# EAGLE schematic sensor_frontend_test_v0.5.e8a143b4 (EAGLE 7.7.0)

## Sheet 1 of 6
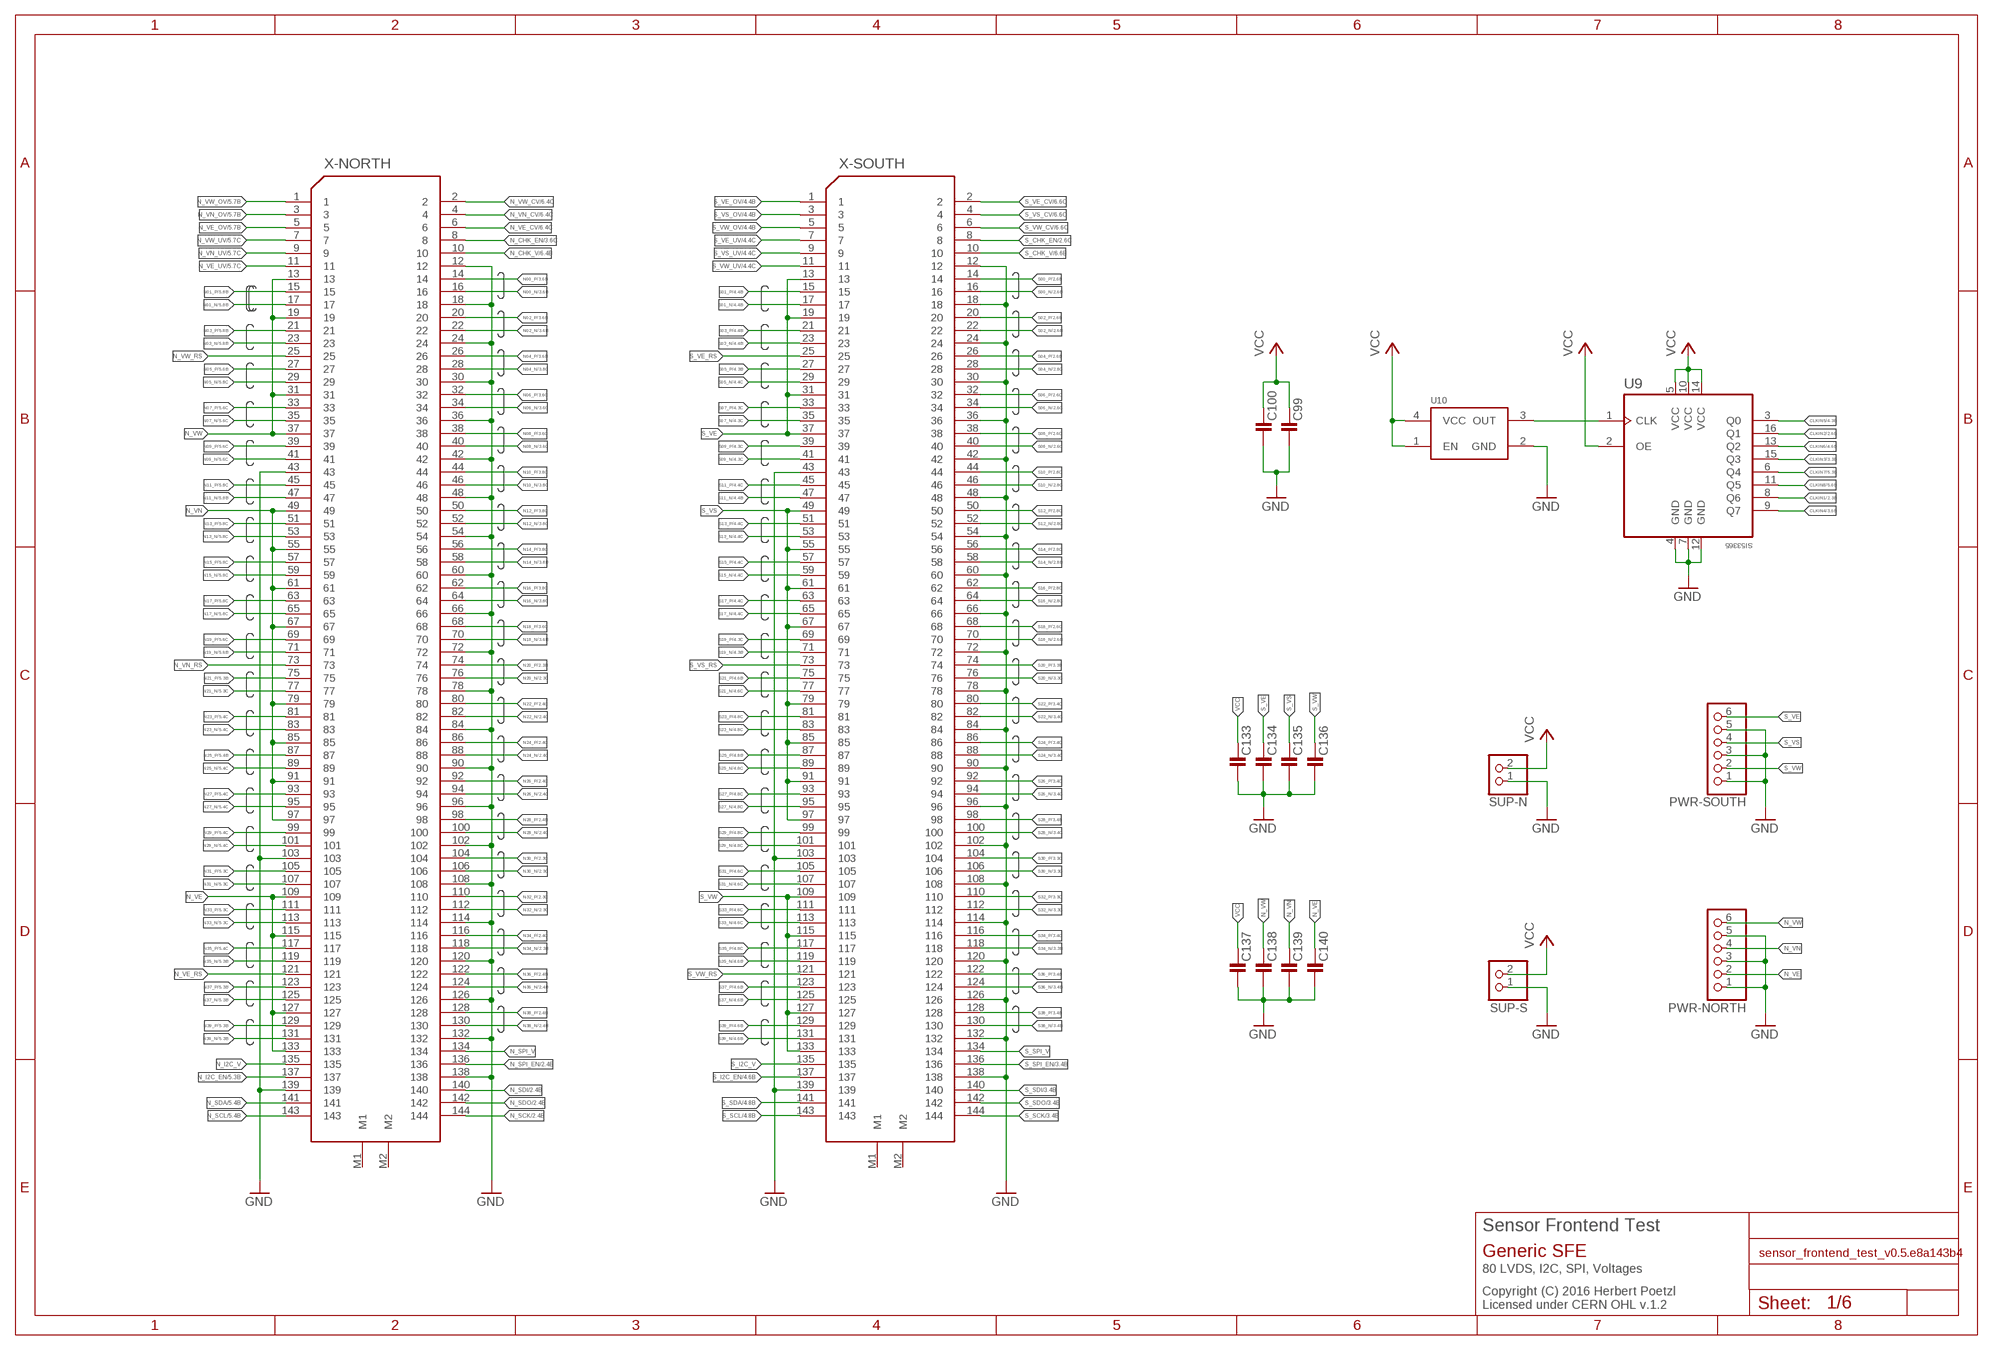
[diagram p0: schematic, sheet 1]

### Parts
C99  C0402-B  [0402-B]
C100  C0402-B  [0402-B]
C133  C0805-A  [0805-A]
C134  C0805-A  [0805-A]
C135  C0805-A  [0805-A]
C136  C0805-A  [0805-A]
C137  C0805-A  [0805-A]
C138  C0805-A  [0805-A]
C139  C0805-A  [0805-A]
C140  C0805-A  [0805-A]
PWR-NORTH  PINHD-1X06_2.54-S  [1X06-S]
PWR-SOUTH  PINHD-1X06_2.54-S  [1X06-S]
SUP-N  PINHD-1X02_2.54-S  [1X02-S]
SUP-S  PINHD-1X02_2.54-S  [1X02-S]
U9  SI53365  [SOP65P640X120-16N]
U10  OSCILLATOR5X3-PIN1-INDICATED  [CRYSTAL-OSC-SMD-5X3]
X-NORTH  FX10-144S  [FX10A-144S]
X-SOUTH  FX10-144S  [FX10A-144S]

### Nets
CLKIN1: U9.8(Q6) ; also sheet 2
CLKIN2: U9.16(Q1) ; also sheet 2
CLKIN3: U9.15(Q3) ; also sheet 3
CLKIN4: U9.9(Q7) ; also sheet 3
CLKIN5: U9.3(Q0) ; also sheet 4
CLKIN6: U9.13(Q2) ; also sheet 4
CLKIN7: U9.6(Q4) ; also sheet 5
CLKIN8: U9.11(Q5) ; also sheet 5
GND [power]: C99.2 C100.2 C133.2 C134.2 C135.2 C136.2 C137.2 C138.2 C139.2 C140.2 PWR-NORTH.1 PWR-NORTH.3 PWR-NORTH.5 PWR-SOUTH.1 PWR-SOUTH.3 PWR-SOUTH.5 SUP-N.1 SUP-S.1 U9.4(GND) U9.7(GND) U9.12(GND) U10.2(GND) X-NORTH.12 X-NORTH.18 X-NORTH.24 X-NORTH.30 X-NORTH.36 X-NORTH.42 X-NORTH.43 X-NORTH.48 X-NORTH.54 X-NORTH.60 X-NORTH.66 X-NORTH.72 X-NORTH.78 X-NORTH.84 X-NORTH.90 X-NORTH.96 X-NORTH.102 X-NORTH.103 X-NORTH.108 X-NORTH.114 X-NORTH.120 X-NORTH.126 X-NORTH.132 X-NORTH.138 X-NORTH.139 X-SOUTH.12 X-SOUTH.18 X-SOUTH.24 X-SOUTH.30 X-SOUTH.36 X-SOUTH.42 X-SOUTH.43 X-SOUTH.48 X-SOUTH.54 X-SOUTH.60 X-SOUTH.66 X-SOUTH.72 X-SOUTH.78 X-SOUTH.84 X-SOUTH.90 X-SOUTH.96 X-SOUTH.102 X-SOUTH.103 X-SOUTH.108 X-SOUTH.114 X-SOUTH.120 X-SOUTH.126 X-SOUTH.132 X-SOUTH.138 X-SOUTH.139 ; also sheet 2,3,4,5,6
N00_N [analog]: X-NORTH.16 ; also sheet 3
N00_P [analog]: X-NORTH.14 ; also sheet 3
N01_N [analog]: X-NORTH.17 ; also sheet 5
N01_P [analog]: X-NORTH.15 ; also sheet 5
N02_N [analog]: X-NORTH.22 ; also sheet 3
N02_P [analog]: X-NORTH.20 ; also sheet 3
N03_N [analog]: X-NORTH.23 ; also sheet 5
N03_P [analog]: X-NORTH.21 ; also sheet 5
N04_N [analog]: X-NORTH.28 ; also sheet 3
N04_P [analog]: X-NORTH.26 ; also sheet 3
N05_N [analog]: X-NORTH.29 ; also sheet 5
N05_P [analog]: X-NORTH.27 ; also sheet 5
N06_N [analog]: X-NORTH.34 ; also sheet 3
N06_P [analog]: X-NORTH.32 ; also sheet 3
N07_N [analog]: X-NORTH.35 ; also sheet 5
N07_P [analog]: X-NORTH.33 ; also sheet 5
N08_N [analog]: X-NORTH.40 ; also sheet 3
N08_P [analog]: X-NORTH.38 ; also sheet 3
N09_N [analog]: X-NORTH.41 ; also sheet 5
N09_P [analog]: X-NORTH.39 ; also sheet 5
N10_N [analog]: X-NORTH.46 ; also sheet 3
N10_P [analog]: X-NORTH.44 ; also sheet 3
N11_N [analog]: X-NORTH.47 ; also sheet 5
N11_P [analog]: X-NORTH.45 ; also sheet 5
N12_N [analog]: X-NORTH.52 ; also sheet 3
N12_P [analog]: X-NORTH.50 ; also sheet 3
N13_N [analog]: X-NORTH.53 ; also sheet 5
N13_P [analog]: X-NORTH.51 ; also sheet 5
N14_N [analog]: X-NORTH.58 ; also sheet 3
N14_P [analog]: X-NORTH.56 ; also sheet 3
N15_N [analog]: X-NORTH.59 ; also sheet 5
N15_P [analog]: X-NORTH.57 ; also sheet 5
N16_N [analog]: X-NORTH.64 ; also sheet 3
N16_P [analog]: X-NORTH.62 ; also sheet 3
N17_N [analog]: X-NORTH.65 ; also sheet 5
N17_P [analog]: X-NORTH.63 ; also sheet 5
N18_N [analog]: X-NORTH.70 ; also sheet 3
N18_P [analog]: X-NORTH.68 ; also sheet 3
N19_N [analog]: X-NORTH.71 ; also sheet 5
N19_P [analog]: X-NORTH.69 ; also sheet 5
N20_N [analog]: X-NORTH.76 ; also sheet 2
N20_P [analog]: X-NORTH.74 ; also sheet 2
N21_N [analog]: X-NORTH.77 ; also sheet 5
N21_P [analog]: X-NORTH.75 ; also sheet 5
N22_N [analog]: X-NORTH.82 ; also sheet 2
N22_P [analog]: X-NORTH.80 ; also sheet 2
N23_N [analog]: X-NORTH.83 ; also sheet 5
N23_P [analog]: X-NORTH.81 ; also sheet 5
N24_N [analog]: X-NORTH.88 ; also sheet 2
N24_P [analog]: X-NORTH.86 ; also sheet 2
N25_N [analog]: X-NORTH.89 ; also sheet 5
N25_P [analog]: X-NORTH.87 ; also sheet 5
N26_N [analog]: X-NORTH.94 ; also sheet 2
N26_P [analog]: X-NORTH.92 ; also sheet 2
N27_N [analog]: X-NORTH.95 ; also sheet 5
N27_P [analog]: X-NORTH.93 ; also sheet 5
N28_N [analog]: X-NORTH.100 ; also sheet 2
N28_P [analog]: X-NORTH.98 ; also sheet 2
N29_N [analog]: X-NORTH.101 ; also sheet 5
N29_P [analog]: X-NORTH.99 ; also sheet 5
N30_N [analog]: X-NORTH.106 ; also sheet 2
N30_P [analog]: X-NORTH.104 ; also sheet 2
N31_N [analog]: X-NORTH.107 ; also sheet 5
N31_P [analog]: X-NORTH.105 ; also sheet 5
N32_N [analog]: X-NORTH.112 ; also sheet 2
N32_P [analog]: X-NORTH.110 ; also sheet 2
N33_N [analog]: X-NORTH.113 ; also sheet 5
N33_P [analog]: X-NORTH.111 ; also sheet 5
N34_N [analog]: X-NORTH.118 ; also sheet 2
N34_P [analog]: X-NORTH.116 ; also sheet 2
N35_N [analog]: X-NORTH.119 ; also sheet 5
N35_P [analog]: X-NORTH.117 ; also sheet 5
N36_N [analog]: X-NORTH.124 ; also sheet 2
N36_P [analog]: X-NORTH.122 ; also sheet 2
N37_N [analog]: X-NORTH.125 ; also sheet 5
N37_P [analog]: X-NORTH.123 ; also sheet 5
N38_N [analog]: X-NORTH.130 ; also sheet 2
N38_P [analog]: X-NORTH.128 ; also sheet 2
N39_N [analog]: X-NORTH.131 ; also sheet 5
N39_P [analog]: X-NORTH.129 ; also sheet 5
N$7: U9.1(CLK) U10.3(OUT)
N_CHK_EN: X-NORTH.8 ; also sheet 3
N_CHK_V: X-NORTH.10 ; also sheet 6
N_I2C_EN: X-NORTH.137 ; also sheet 5
N_I2C_V: X-NORTH.135
N_SCK: X-NORTH.144 ; also sheet 2
N_SCL: X-NORTH.143 ; also sheet 5
N_SDA: X-NORTH.141 ; also sheet 5
N_SDI: X-NORTH.140 ; also sheet 2
N_SDO: X-NORTH.142 ; also sheet 2
N_SPI_EN: X-NORTH.136 ; also sheet 2
N_SPI_V: X-NORTH.134
N_VE [power]: C140.1 PWR-NORTH.2 X-NORTH.109 X-NORTH.115 X-NORTH.127 X-NORTH.133
N_VE_CV: X-NORTH.6 ; also sheet 6
N_VE_OV: X-NORTH.5 ; also sheet 5
N_VE_RS: X-NORTH.121
N_VE_UV: X-NORTH.11 ; also sheet 5
N_VN [power]: C139.1 PWR-NORTH.4 X-NORTH.49 X-NORTH.55 X-NORTH.61 X-NORTH.67 X-NORTH.79 X-NORTH.85 X-NORTH.91 X-NORTH.97
N_VN_CV: X-NORTH.4 ; also sheet 6
N_VN_OV: X-NORTH.3 ; also sheet 5
N_VN_RS: X-NORTH.73
N_VN_UV: X-NORTH.9 ; also sheet 5
N_VW [power]: C138.1 PWR-NORTH.6 X-NORTH.13 X-NORTH.19 X-NORTH.31 X-NORTH.37
N_VW_CV: X-NORTH.2 ; also sheet 6
N_VW_OV: X-NORTH.1 ; also sheet 5
N_VW_RS: X-NORTH.25
N_VW_UV: X-NORTH.7 ; also sheet 5
S00_N [analog]: X-SOUTH.16 ; also sheet 2
S00_P [analog]: X-SOUTH.14 ; also sheet 2
S01_N [analog]: X-SOUTH.17 ; also sheet 4
S01_P [analog]: X-SOUTH.15 ; also sheet 4
S02_N [analog]: X-SOUTH.22 ; also sheet 2
S02_P [analog]: X-SOUTH.20 ; also sheet 2
S03_N [analog]: X-SOUTH.23 ; also sheet 4
S03_P [analog]: X-SOUTH.21 ; also sheet 4
S04_N [analog]: X-SOUTH.28 ; also sheet 2
S04_P [analog]: X-SOUTH.26 ; also sheet 2
S05_N [analog]: X-SOUTH.29 ; also sheet 4
S05_P [analog]: X-SOUTH.27 ; also sheet 4
S06_N [analog]: X-SOUTH.34 ; also sheet 2
S06_P [analog]: X-SOUTH.32 ; also sheet 2
S07_N [analog]: X-SOUTH.35 ; also sheet 4
S07_P [analog]: X-SOUTH.33 ; also sheet 4
S08_N [analog]: X-SOUTH.40 ; also sheet 2
S08_P [analog]: X-SOUTH.38 ; also sheet 2
S09_N [analog]: X-SOUTH.41 ; also sheet 4
S09_P [analog]: X-SOUTH.39 ; also sheet 4
S10_N [analog]: X-SOUTH.46 ; also sheet 2
S10_P [analog]: X-SOUTH.44 ; also sheet 2
S11_N [analog]: X-SOUTH.47 ; also sheet 4
S11_P [analog]: X-SOUTH.45 ; also sheet 4
S12_N [analog]: X-SOUTH.52 ; also sheet 2
S12_P [analog]: X-SOUTH.50 ; also sheet 2
S13_N [analog]: X-SOUTH.53 ; also sheet 4
S13_P [analog]: X-SOUTH.51 ; also sheet 4
S14_N [analog]: X-SOUTH.58 ; also sheet 2
S14_P [analog]: X-SOUTH.56 ; also sheet 2
S15_N [analog]: X-SOUTH.59 ; also sheet 4
S15_P [analog]: X-SOUTH.57 ; also sheet 4
S16_N [analog]: X-SOUTH.64 ; also sheet 2
S16_P [analog]: X-SOUTH.62 ; also sheet 2
S17_N [analog]: X-SOUTH.65 ; also sheet 4
S17_P [analog]: X-SOUTH.63 ; also sheet 4
S18_N [analog]: X-SOUTH.70 ; also sheet 2
S18_P [analog]: X-SOUTH.68 ; also sheet 2
S19_N [analog]: X-SOUTH.71 ; also sheet 4
S19_P [analog]: X-SOUTH.69 ; also sheet 4
S20_N [analog]: X-SOUTH.76 ; also sheet 3
S20_P [analog]: X-SOUTH.74 ; also sheet 3
S21_N [analog]: X-SOUTH.77 ; also sheet 4
S21_P [analog]: X-SOUTH.75 ; also sheet 4
S22_N [analog]: X-SOUTH.82 ; also sheet 3
S22_P [analog]: X-SOUTH.80 ; also sheet 3
S23_N [analog]: X-SOUTH.83 ; also sheet 4
S23_P [analog]: X-SOUTH.81 ; also sheet 4
S24_N [analog]: X-SOUTH.88 ; also sheet 3
S24_P [analog]: X-SOUTH.86 ; also sheet 3
S25_N [analog]: X-SOUTH.89 ; also sheet 4
S25_P [analog]: X-SOUTH.87 ; also sheet 4
S26_N [analog]: X-SOUTH.94 ; also sheet 3
S26_P [analog]: X-SOUTH.92 ; also sheet 3
S27_N [analog]: X-SOUTH.95 ; also sheet 4
S27_P [analog]: X-SOUTH.93 ; also sheet 4
S28_N [analog]: X-SOUTH.100 ; also sheet 3
S28_P [analog]: X-SOUTH.98 ; also sheet 3
S29_N [analog]: X-SOUTH.101 ; also sheet 4
S29_P [analog]: X-SOUTH.99 ; also sheet 4
S30_N [analog]: X-SOUTH.106 ; also sheet 3
S30_P [analog]: X-SOUTH.104 ; also sheet 3
S31_N [analog]: X-SOUTH.107 ; also sheet 4
S31_P [analog]: X-SOUTH.105 ; also sheet 4
S32_N [analog]: X-SOUTH.112 ; also sheet 3
S32_P [analog]: X-SOUTH.110 ; also sheet 3
S33_N [analog]: X-SOUTH.113 ; also sheet 4
S33_P [analog]: X-SOUTH.111 ; also sheet 4
S34_N [analog]: X-SOUTH.118 ; also sheet 3
S34_P [analog]: X-SOUTH.116 ; also sheet 3
S35_N [analog]: X-SOUTH.119 ; also sheet 4
S35_P [analog]: X-SOUTH.117 ; also sheet 4
S36_N [analog]: X-SOUTH.124 ; also sheet 3
S36_P [analog]: X-SOUTH.122 ; also sheet 3
S37_N [analog]: X-SOUTH.125 ; also sheet 4
S37_P [analog]: X-SOUTH.123 ; also sheet 4
S38_N [analog]: X-SOUTH.130 ; also sheet 3
S38_P [analog]: X-SOUTH.128 ; also sheet 3
S39_N [analog]: X-SOUTH.131 ; also sheet 4
S39_P [analog]: X-SOUTH.129 ; also sheet 4
S_CHK_EN: X-SOUTH.8 ; also sheet 2
S_CHK_V: X-SOUTH.10 ; also sheet 6
S_I2C_EN: X-SOUTH.137 ; also sheet 4
S_I2C_V: X-SOUTH.135
S_SCK: X-SOUTH.144 ; also sheet 3
S_SCL: X-SOUTH.143 ; also sheet 4
S_SDA: X-SOUTH.141 ; also sheet 4
S_SDI: X-SOUTH.140 ; also sheet 3
S_SDO: X-SOUTH.142 ; also sheet 3
S_SPI_EN: X-SOUTH.136 ; also sheet 3
S_SPI_V: X-SOUTH.134
S_VE [power]: C134.1 PWR-SOUTH.6 X-SOUTH.13 X-SOUTH.19 X-SOUTH.31 X-SOUTH.37
S_VE_CV: X-SOUTH.2 ; also sheet 6
S_VE_OV: X-SOUTH.1 ; also sheet 4
S_VE_RS: X-SOUTH.25
S_VE_UV: X-SOUTH.7 ; also sheet 4
S_VS [power]: C135.1 PWR-SOUTH.4 X-SOUTH.49 X-SOUTH.55 X-SOUTH.61 X-SOUTH.67 X-SOUTH.79 X-SOUTH.85 X-SOUTH.91 X-SOUTH.97
S_VS_CV: X-SOUTH.4 ; also sheet 6
S_VS_OV: X-SOUTH.3 ; also sheet 4
S_VS_RS: X-SOUTH.73
S_VS_UV: X-SOUTH.9 ; also sheet 4
S_VW [power]: C136.1 PWR-SOUTH.2 X-SOUTH.109 X-SOUTH.115 X-SOUTH.127 X-SOUTH.133
S_VW_CV: X-SOUTH.6 ; also sheet 6
S_VW_OV: X-SOUTH.5 ; also sheet 4
S_VW_RS: X-SOUTH.121
S_VW_UV: X-SOUTH.11 ; also sheet 4
VCC [power]: C99.1 C100.1 C133.1 C137.1 SUP-N.2 SUP-S.2 U9.2(OE) U9.5(VCC) U9.10(VCC) U9.14(VCC) U10.1(EN) U10.4(VCC) ; also sheet 2,3,4,5
Unconnected: X-NORTH.M1 X-NORTH.M2 X-SOUTH.M1 X-SOUTH.M2

### Notes on the sheet
- Sensor Frontend Test
- Generic SFE
- 80 LVDS, I2C, SPI, Voltages
- Copyright (C) 2016 Herbert Poetzl
  Licensed under CERN OHL v.1.2

## Sheet 2 of 6
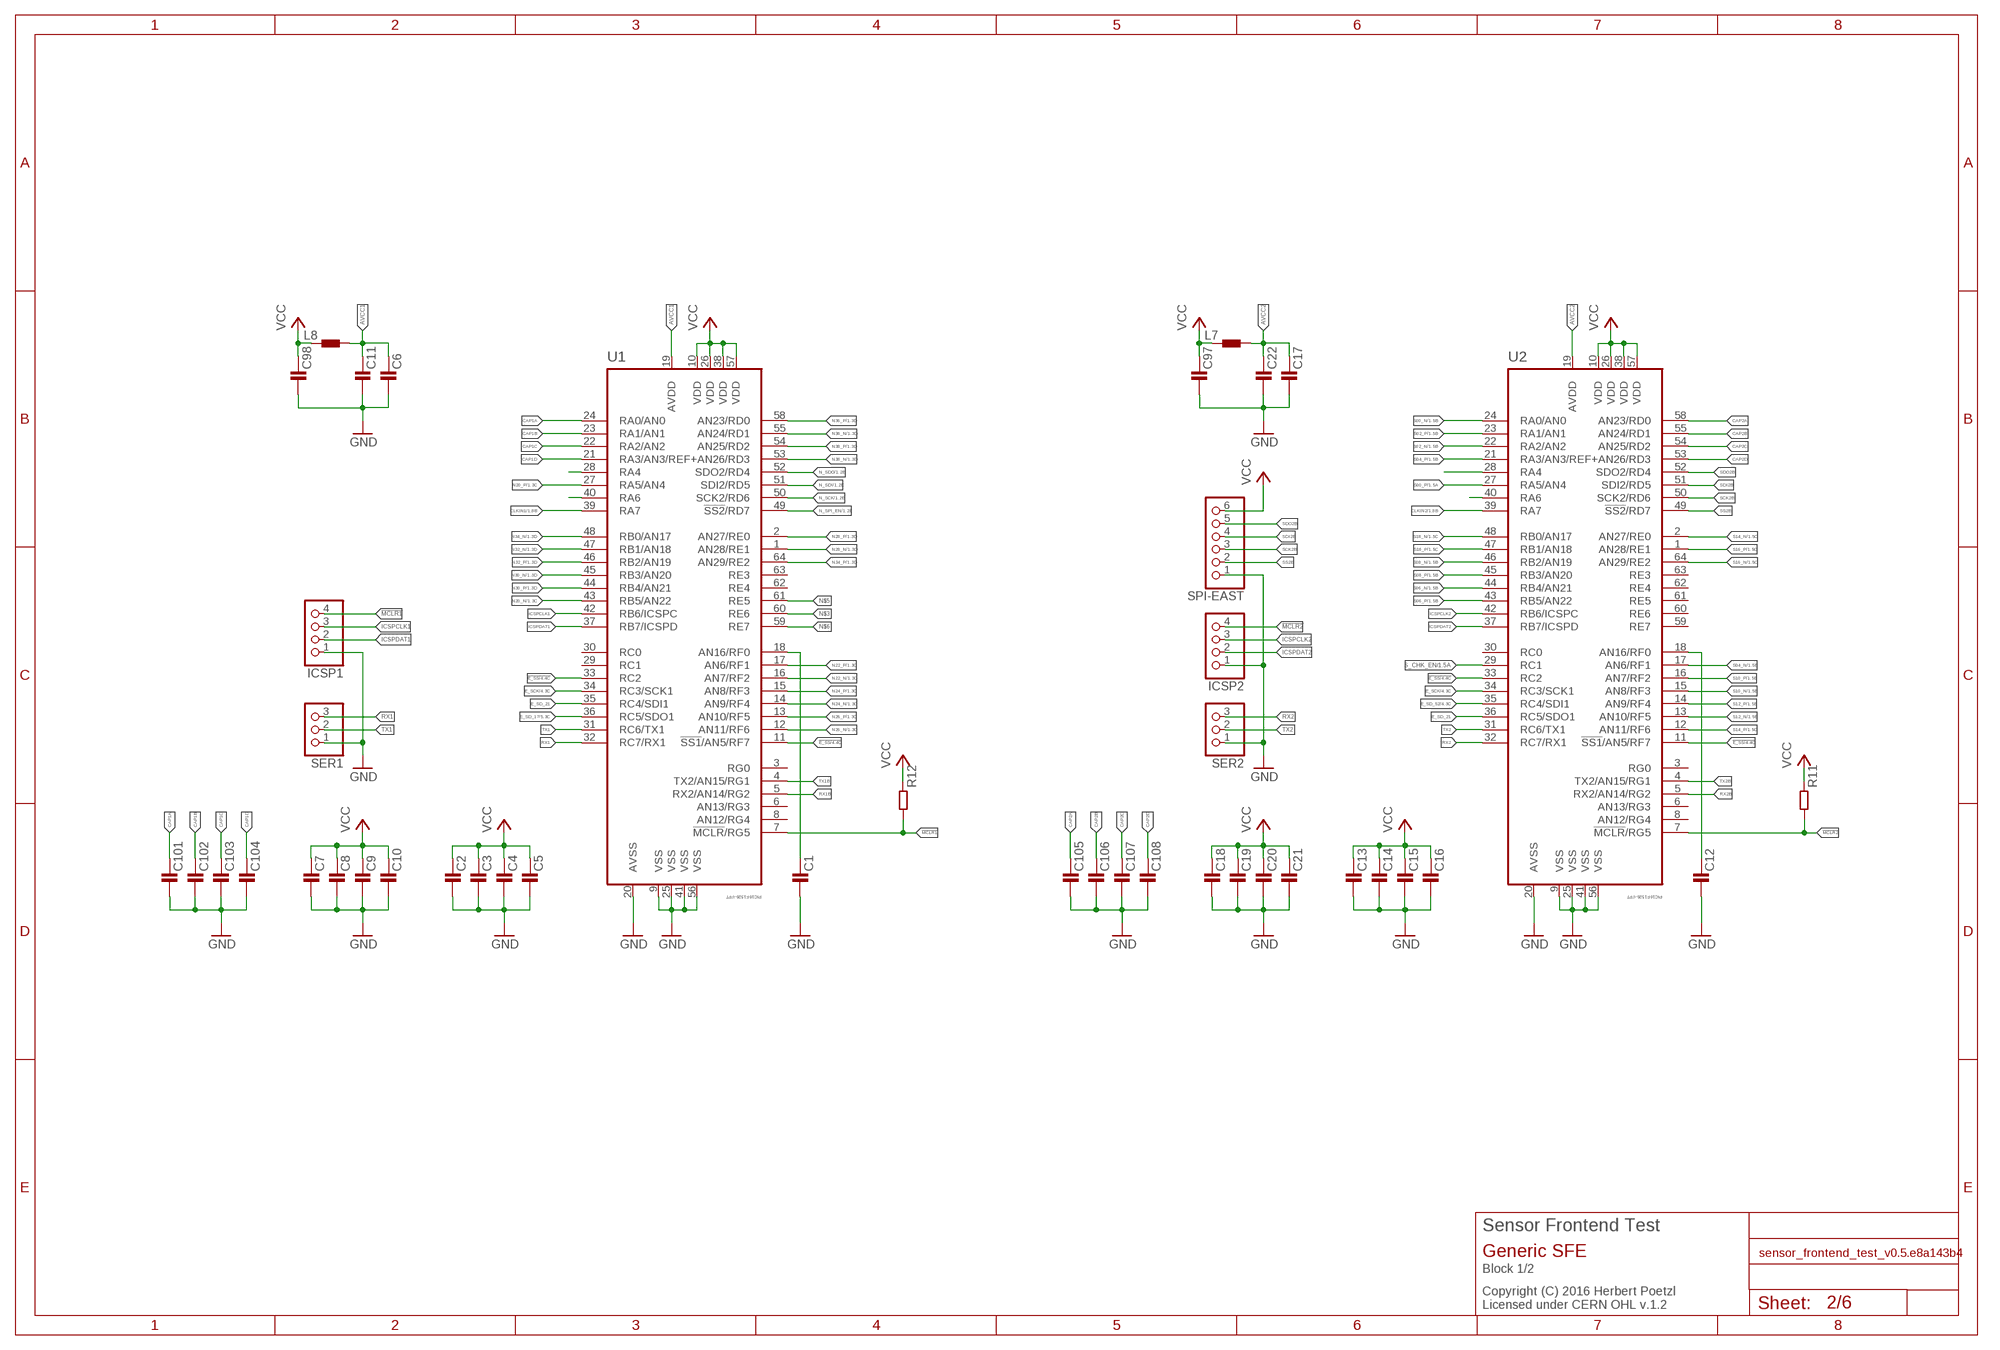
[diagram p1: schematic, sheet 2]

### Parts
C1  C0402-B  [0402-B]
C2  C0402-B  [0402-B]
C3  C0402-B  [0402-B]
C4  C0402-B  [0402-B]
C5  C0402-B  [0402-B]
C6  C0402-B  [0402-B]
C7  C0402-B  [0402-B]
C8  C0402-B  [0402-B]
C9  C0402-B  [0402-B]
C10  C0402-B  [0402-B]
C11  C0402-B  [0402-B]
C12  C0402-B  [0402-B]
C13  C0402-B  [0402-B]
C14  C0402-B  [0402-B]
C15  C0402-B  [0402-B]
C16  C0402-B  [0402-B]
C17  C0402-B  [0402-B]
C18  C0402-B  [0402-B]
C19  C0402-B  [0402-B]
C20  C0402-B  [0402-B]
C21  C0402-B  [0402-B]
C22  C0402-B  [0402-B]
C97  C0402-B  [0402-B]
C98  C0402-B  [0402-B]
C101  C0402-B  [0402-B]
C102  C0402-B  [0402-B]
C103  C0603-B  [0603-B]
C104  C0603-B  [0603-B]
C105  C0402-B  [0402-B]
C106  C0402-B  [0402-B]
C107  C0603-B  [0603-B]
C108  C0603-B  [0603-B]
ICSP1  PINHD-1X04_2.00  [1X04M]
ICSP2  PINHD-1X04_2.00  [1X04M]
L7  L0402-B  [0402-B]
L8  L0402-B  [0402-B]
R11  R0402-B  [0402-B]
R12  R0402-B  [0402-B]
SER1  PINHD-1X03_2.00  [1X03M]
SER2  PINHD-1X03_2.00  [1X03M]
SPI-EAST  PINHD-1X06_2.00  [1X06M]
U1  PIC16F1526-I/PT  [QFP50P1200X1200X120-64N]
U2  PIC16F1526-I/PT  [QFP50P1200X1200X120-64N]

### Nets
!E_SS: U1.11(!SS1!/AN5/RF7) U1.33(RC2) U2.11(!SS1!/AN5/RF7) U2.33(RC2) ; also sheet 4,5
!MCLR1!: ICSP1.4 R12.2 U1.7(!MCLR!/RG5)
!MCLR2!: ICSP2.4 R11.2 U2.7(!MCLR!/RG5)
AVCC1 [power]: C6.1 C11.1 L8.2 U1.19(AVDD)
AVCC2 [power]: C17.1 C22.1 L7.2 U2.19(AVDD)
CAP1A [analog]: C101.1 U1.24(RA0/AN0)
CAP1B [analog]: C102.1 U1.23(RA1/AN1)
CAP1C [analog]: C103.1 U1.22(RA2/AN2)
CAP1D [analog]: C104.1 U1.21(RA3/AN3/REF+)
CAP2A [analog]: C105.1 U2.58(AN23/RD0)
CAP2B [analog]: C106.1 U2.55(AN24/RD1)
CAP2C [analog]: C107.1 U2.54(AN25/RD2)
CAP2D [analog]: C108.1 U2.53(AN26/RD3)
CLKIN1: U1.39(RA7) ; also sheet 1
CLKIN2: U2.39(RA7) ; also sheet 1
E_SCK: U1.34(RC3/SCK1) U2.34(RC3/SCK1) ; also sheet 4,5
E_SD_17: U1.36(RC5/SDO1) ; also sheet 5
E_SD_21: U1.35(RC4/SDI1) U2.36(RC5/SDO1)
E_SD_52: U2.35(RC4/SDI1) ; also sheet 4
GND [power]: C1.2 C2.2 C3.2 C4.2 C5.2 C6.2 C7.2 C8.2 C9.2 C10.2 C11.2 C12.2 C13.2 C14.2 C15.2 C16.2 C17.2 C18.2 C19.2 C20.2 C21.2 C22.2 C97.2 C98.2 C101.2 C102.2 C103.2 C104.2 C105.2 C106.2 C107.2 C108.2 ICSP1.1 ICSP2.1 SER1.1 SER2.1 SPI-EAST.1 U1.9(VSS) U1.20(AVSS) U1.25(VSS) U1.41(VSS) U1.56(VSS) U2.9(VSS) U2.20(AVSS) U2.25(VSS) U2.41(VSS) U2.56(VSS) ; also sheet 1,3,4,5,6
ICSPCLK1: ICSP1.3 U1.42(RB6/ICSPC)
ICSPCLK2: ICSP2.3 U2.42(RB6/ICSPC)
ICSPDAT1: ICSP1.2 U1.37(RB7/ICSPD)
ICSPDAT2: ICSP2.2 U2.37(RB7/ICSPD)
N20_N [analog]: U1.43(RB5/AN22) ; also sheet 1
N20_P [analog]: U1.27(RA5/AN4) ; also sheet 1
N22_N [analog]: U1.16(AN7/RF2) ; also sheet 1
N22_P [analog]: U1.17(AN6/RF1) ; also sheet 1
N24_N [analog]: U1.14(AN9/RF4) ; also sheet 1
N24_P [analog]: U1.15(AN8/RF3) ; also sheet 1
N26_N [analog]: U1.12(AN11/RF6) ; also sheet 1
N26_P [analog]: U1.13(AN10/RF5) ; also sheet 1
N28_N [analog]: U1.1(AN28/RE1) ; also sheet 1
N28_P [analog]: U1.2(AN27/RE0) ; also sheet 1
N30_N [analog]: U1.45(RB3/AN20) ; also sheet 1
N30_P [analog]: U1.44(RB4/AN21) ; also sheet 1
N32_N [analog]: U1.47(RB1/AN18) ; also sheet 1
N32_P [analog]: U1.46(RB2/AN19) ; also sheet 1
N34_N [analog]: U1.48(RB0/AN17) ; also sheet 1
N34_P [analog]: U1.64(AN29/RE2) ; also sheet 1
N36_N [analog]: U1.55(AN24/RD1) ; also sheet 1
N36_P [analog]: U1.58(AN23/RD0) ; also sheet 1
N38_N [analog]: U1.53(AN26/RD3) ; also sheet 1
N38_P [analog]: U1.54(AN25/RD2) ; also sheet 1
N$3: U1.60(RE6)
N$5: U1.61(RE5)
N$6: U1.59(RE7)
N$8: U1.40(RA6)
N$9: U2.40(RA6)
N$15: C1.1 U1.18(AN16/RF0)
N$64: U1.28(RA4)
N$69: C12.1 U2.18(AN16/RF0)
N$91: U2.28(RA4)
N_SCK: U1.50(SCK2/RD6) ; also sheet 1
N_SDI: U1.51(SDI2/RD5) ; also sheet 1
N_SDO: U1.52(SDO2/RD4) ; also sheet 1
N_SPI_EN: U1.49(!SS2!/RD7) ; also sheet 1
RX1: SER1.3 U1.32(RC7/RX1)
RX1B: U1.5(RX2/AN14/RG2)
RX2: SER2.3 U2.32(RC7/RX1)
RX2B: U2.5(RX2/AN14/RG2)
S00_N [analog]: U2.24(RA0/AN0) ; also sheet 1
S00_P [analog]: U2.27(RA5/AN4) ; also sheet 1
S02_N [analog]: U2.22(RA2/AN2) ; also sheet 1
S02_P [analog]: U2.23(RA1/AN1) ; also sheet 1
S04_N [analog]: U2.17(AN6/RF1) ; also sheet 1
S04_P [analog]: U2.21(RA3/AN3/REF+) ; also sheet 1
S06_N [analog]: U2.44(RB4/AN21) ; also sheet 1
S06_P [analog]: U2.43(RB5/AN22) ; also sheet 1
S08_N [analog]: U2.46(RB2/AN19) ; also sheet 1
S08_P [analog]: U2.45(RB3/AN20) ; also sheet 1
S10_N [analog]: U2.15(AN8/RF3) ; also sheet 1
S10_P [analog]: U2.16(AN7/RF2) ; also sheet 1
S12_N [analog]: U2.13(AN10/RF5) ; also sheet 1
S12_P [analog]: U2.14(AN9/RF4) ; also sheet 1
S14_N [analog]: U2.2(AN27/RE0) ; also sheet 1
S14_P [analog]: U2.12(AN11/RF6) ; also sheet 1
S16_N [analog]: U2.64(AN29/RE2) ; also sheet 1
S16_P [analog]: U2.1(AN28/RE1) ; also sheet 1
S18_N [analog]: U2.48(RB0/AN17) ; also sheet 1
S18_P [analog]: U2.47(RB1/AN18) ; also sheet 1
S_CHK_EN: U2.29(RC1) ; also sheet 1
SCK2B: SPI-EAST.3 U2.50(SCK2/RD6)
SDI2B: SPI-EAST.4 U2.51(SDI2/RD5)
SDO2B: SPI-EAST.5 U2.52(SDO2/RD4)
SS2B: SPI-EAST.2 U2.49(!SS2!/RD7)
TX1: SER1.2 U1.31(RC6/TX1)
TX1B: U1.4(TX2/AN15/RG1)
TX2: SER2.2 U2.31(RC6/TX1)
TX2B: U2.4(TX2/AN15/RG1)
VCC [power]: C2.1 C3.1 C4.1 C5.1 C7.1 C8.1 C9.1 C10.1 C13.1 C14.1 C15.1 C16.1 C18.1 C19.1 C20.1 C21.1 C97.1 C98.1 L7.1 L8.1 R11.1 R12.1 SPI-EAST.6 U1.10(VDD) U1.26(VDD) U1.38(VDD) U1.57(VDD) U2.10(VDD) U2.26(VDD) U2.38(VDD) U2.57(VDD) ; also sheet 1,3,4,5
Unconnected: U1.3(RG0) U1.6(AN13/RG3) U1.8(AN12/RG4) U1.29(RC1) U1.30(RC0) U1.62(RE4) U1.63(RE3) U2.3(RG0) U2.6(AN13/RG3) U2.8(AN12/RG4) U2.30(RC0) U2.59(RE7) U2.60(RE6) U2.61(RE5) U2.62(RE4) U2.63(RE3)

### Notes on the sheet
- Sensor Frontend Test
- Generic SFE
- Block 1/2
- Copyright (C) 2016 Herbert Poetzl
  Licensed under CERN OHL v.1.2

## Sheet 3 of 6
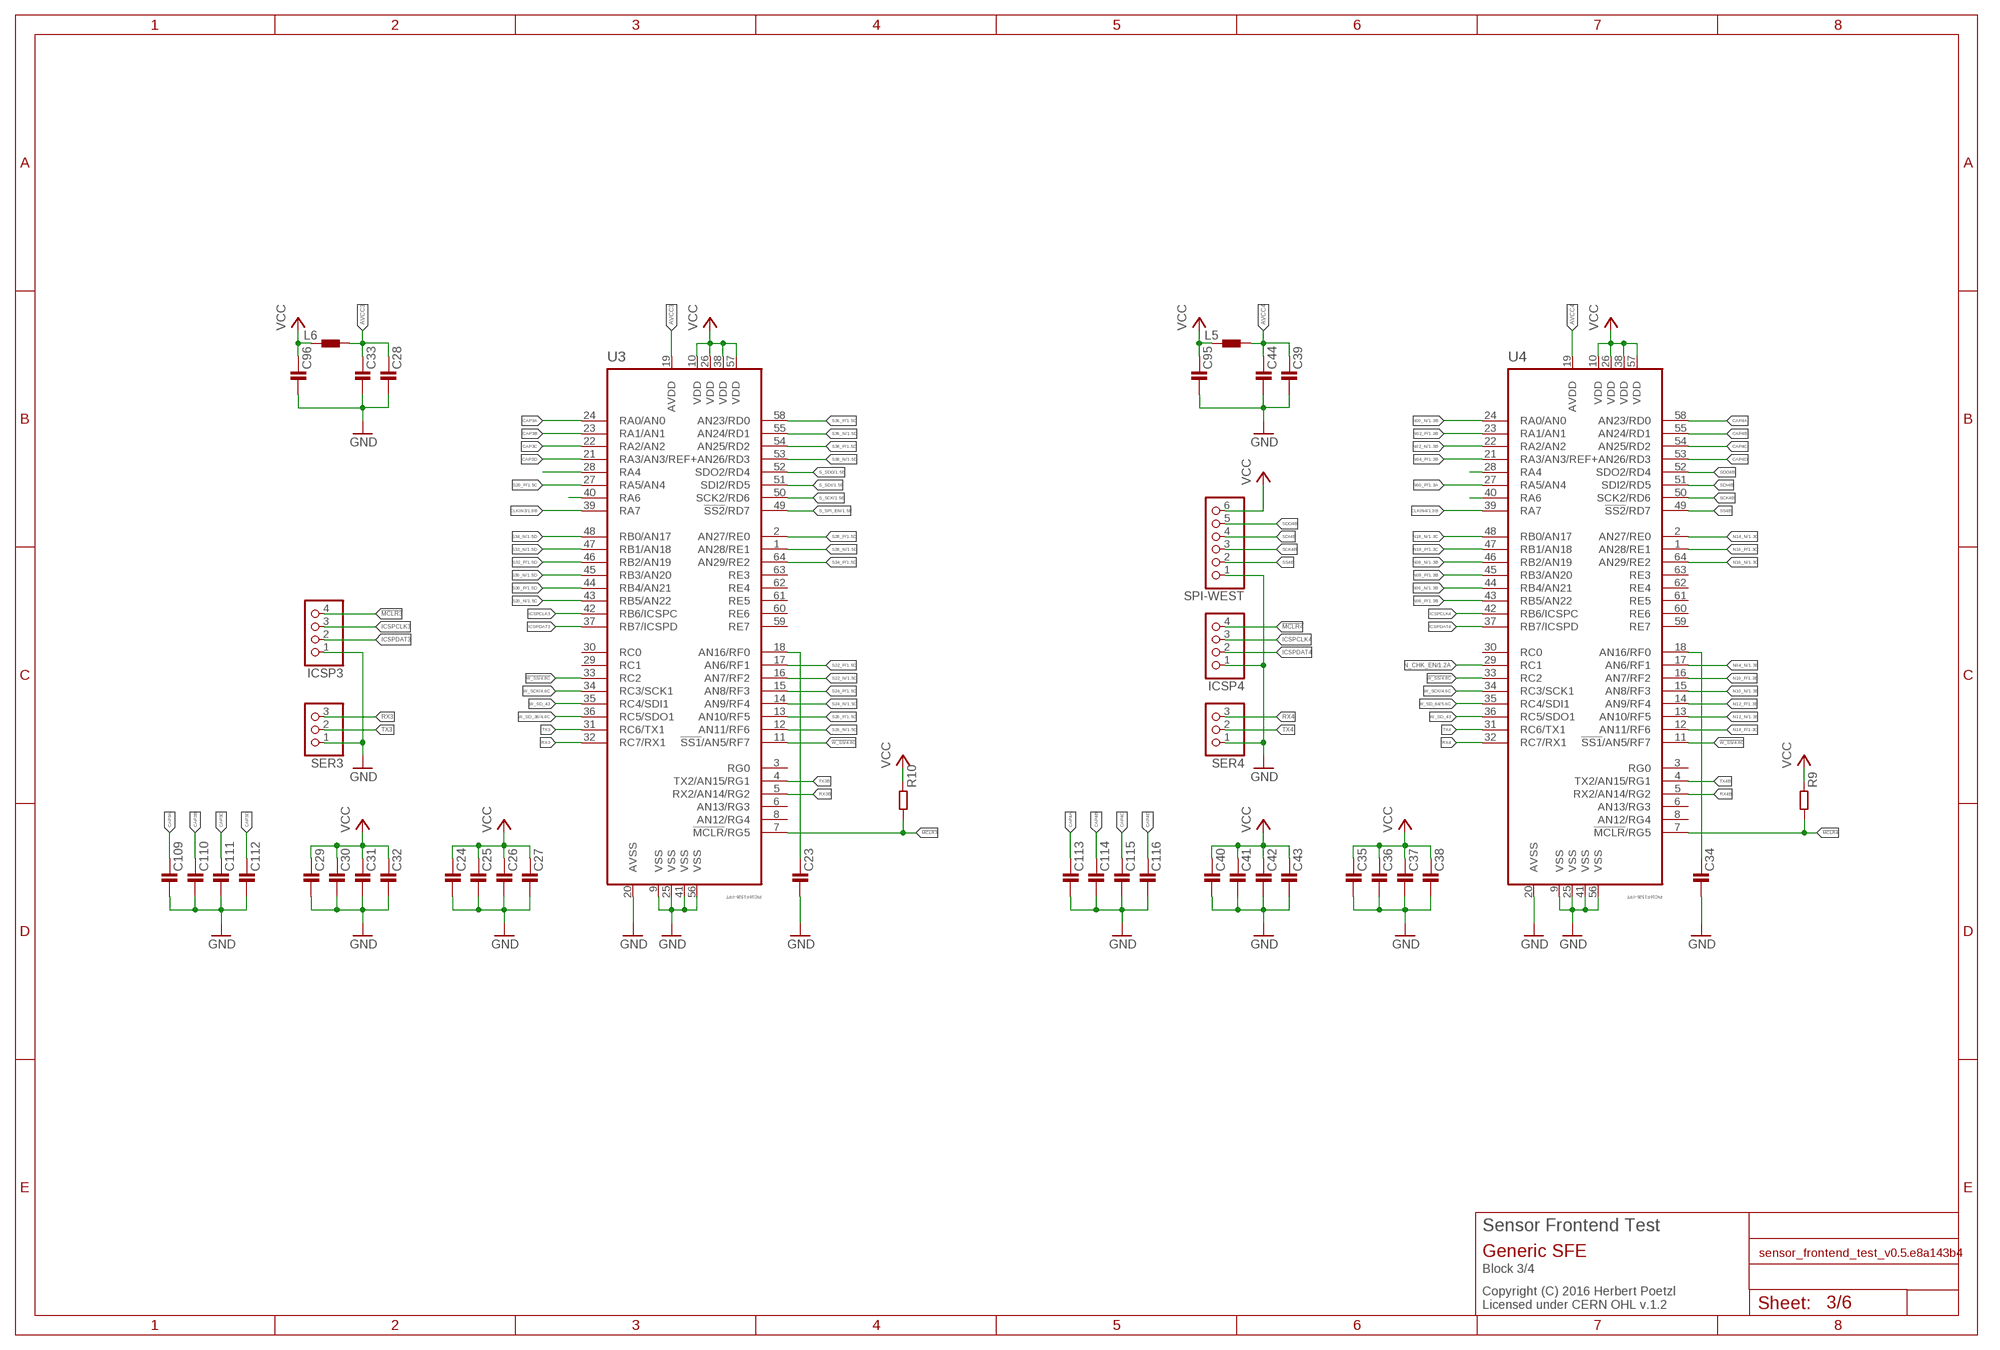
[diagram p2: schematic, sheet 3]

### Parts
C23  C0402-B  [0402-B]
C24  C0402-B  [0402-B]
C25  C0402-B  [0402-B]
C26  C0402-B  [0402-B]
C27  C0402-B  [0402-B]
C28  C0402-B  [0402-B]
C29  C0402-B  [0402-B]
C30  C0402-B  [0402-B]
C31  C0402-B  [0402-B]
C32  C0402-B  [0402-B]
C33  C0402-B  [0402-B]
C34  C0402-B  [0402-B]
C35  C0402-B  [0402-B]
C36  C0402-B  [0402-B]
C37  C0402-B  [0402-B]
C38  C0402-B  [0402-B]
C39  C0402-B  [0402-B]
C40  C0402-B  [0402-B]
C41  C0402-B  [0402-B]
C42  C0402-B  [0402-B]
C43  C0402-B  [0402-B]
C44  C0402-B  [0402-B]
C95  C0402-B  [0402-B]
C96  C0402-B  [0402-B]
C109  C0402-B  [0402-B]
C110  C0402-B  [0402-B]
C111  C0603-B  [0603-B]
C112  C0603-B  [0603-B]
C113  C0402-B  [0402-B]
C114  C0402-B  [0402-B]
C115  C0603-B  [0603-B]
C116  C0603-B  [0603-B]
ICSP3  PINHD-1X04_2.00  [1X04M]
ICSP4  PINHD-1X04_2.00  [1X04M]
L5  L0402-B  [0402-B]
L6  L0402-B  [0402-B]
R9  R0402-B  [0402-B]
R10  R0402-B  [0402-B]
SER3  PINHD-1X03_2.00  [1X03M]
SER4  PINHD-1X03_2.00  [1X03M]
SPI-WEST  PINHD-1X06_2.00  [1X06M]
U3  PIC16F1526-I/PT  [QFP50P1200X1200X120-64N]
U4  PIC16F1526-I/PT  [QFP50P1200X1200X120-64N]

### Nets
!MCLR3!: ICSP3.4 R10.2 U3.7(!MCLR!/RG5)
!MCLR4!: ICSP4.4 R9.2 U4.7(!MCLR!/RG5)
!W_SS: U3.11(!SS1!/AN5/RF7) U3.33(RC2) U4.11(!SS1!/AN5/RF7) U4.33(RC2) ; also sheet 4,5
AVCC3 [power]: C28.1 C33.1 L6.2 U3.19(AVDD)
AVCC4 [power]: C39.1 C44.1 L5.2 U4.19(AVDD)
CAP3A [analog]: C109.1 U3.24(RA0/AN0)
CAP3B [analog]: C110.1 U3.23(RA1/AN1)
CAP3C [analog]: C111.1 U3.22(RA2/AN2)
CAP3D [analog]: C112.1 U3.21(RA3/AN3/REF+)
CAP4A [analog]: C113.1 U4.58(AN23/RD0)
CAP4B [analog]: C114.1 U4.55(AN24/RD1)
CAP4C [analog]: C115.1 U4.54(AN25/RD2)
CAP4D [analog]: C116.1 U4.53(AN26/RD3)
CLKIN3: U3.39(RA7) ; also sheet 1
CLKIN4: U4.39(RA7) ; also sheet 1
GND [power]: C23.2 C24.2 C25.2 C26.2 C27.2 C28.2 C29.2 C30.2 C31.2 C32.2 C33.2 C34.2 C35.2 C36.2 C37.2 C38.2 C39.2 C40.2 C41.2 C42.2 C43.2 C44.2 C95.2 C96.2 C109.2 C110.2 C111.2 C112.2 C113.2 C114.2 C115.2 C116.2 ICSP3.1 ICSP4.1 SER3.1 SER4.1 SPI-WEST.1 U3.9(VSS) U3.20(AVSS) U3.25(VSS) U3.41(VSS) U3.56(VSS) U4.9(VSS) U4.20(AVSS) U4.25(VSS) U4.41(VSS) U4.56(VSS) ; also sheet 1,2,4,5,6
ICSPCLK3: ICSP3.3 U3.42(RB6/ICSPC)
ICSPCLK4: ICSP4.3 U4.42(RB6/ICSPC)
ICSPDAT3: ICSP3.2 U3.37(RB7/ICSPD)
ICSPDAT4: ICSP4.2 U4.37(RB7/ICSPD)
N00_N [analog]: U4.24(RA0/AN0) ; also sheet 1
N00_P [analog]: U4.27(RA5/AN4) ; also sheet 1
N02_N [analog]: U4.22(RA2/AN2) ; also sheet 1
N02_P [analog]: U4.23(RA1/AN1) ; also sheet 1
N04_N [analog]: U4.17(AN6/RF1) ; also sheet 1
N04_P [analog]: U4.21(RA3/AN3/REF+) ; also sheet 1
N06_N [analog]: U4.44(RB4/AN21) ; also sheet 1
N06_P [analog]: U4.43(RB5/AN22) ; also sheet 1
N08_N [analog]: U4.46(RB2/AN19) ; also sheet 1
N08_P [analog]: U4.45(RB3/AN20) ; also sheet 1
N10_N [analog]: U4.15(AN8/RF3) ; also sheet 1
N10_P [analog]: U4.16(AN7/RF2) ; also sheet 1
N12_N [analog]: U4.13(AN10/RF5) ; also sheet 1
N12_P [analog]: U4.14(AN9/RF4) ; also sheet 1
N14_N [analog]: U4.2(AN27/RE0) ; also sheet 1
N14_P [analog]: U4.12(AN11/RF6) ; also sheet 1
N16_N [analog]: U4.64(AN29/RE2) ; also sheet 1
N16_P [analog]: U4.1(AN28/RE1) ; also sheet 1
N18_N [analog]: U4.48(RB0/AN17) ; also sheet 1
N18_P [analog]: U4.47(RB1/AN18) ; also sheet 1
N$18: U3.40(RA6)
N$27: U4.40(RA6)
N$96: C23.1 U3.18(AN16/RF0)
N$118: U3.28(RA4)
N$123: C34.1 U4.18(AN16/RF0)
N$145: U4.28(RA4)
N_CHK_EN: U4.29(RC1) ; also sheet 1
RX3: SER3.3 U3.32(RC7/RX1)
RX3B: U3.5(RX2/AN14/RG2)
RX4: SER4.3 U4.32(RC7/RX1)
RX4B: U4.5(RX2/AN14/RG2)
S20_N [analog]: U3.43(RB5/AN22) ; also sheet 1
S20_P [analog]: U3.27(RA5/AN4) ; also sheet 1
S22_N [analog]: U3.16(AN7/RF2) ; also sheet 1
S22_P [analog]: U3.17(AN6/RF1) ; also sheet 1
S24_N [analog]: U3.14(AN9/RF4) ; also sheet 1
S24_P [analog]: U3.15(AN8/RF3) ; also sheet 1
S26_N [analog]: U3.12(AN11/RF6) ; also sheet 1
S26_P [analog]: U3.13(AN10/RF5) ; also sheet 1
S28_N [analog]: U3.1(AN28/RE1) ; also sheet 1
S28_P [analog]: U3.2(AN27/RE0) ; also sheet 1
S30_N [analog]: U3.45(RB3/AN20) ; also sheet 1
S30_P [analog]: U3.44(RB4/AN21) ; also sheet 1
S32_N [analog]: U3.47(RB1/AN18) ; also sheet 1
S32_P [analog]: U3.46(RB2/AN19) ; also sheet 1
S34_N [analog]: U3.48(RB0/AN17) ; also sheet 1
S34_P [analog]: U3.64(AN29/RE2) ; also sheet 1
S36_N [analog]: U3.55(AN24/RD1) ; also sheet 1
S36_P [analog]: U3.58(AN23/RD0) ; also sheet 1
S38_N [analog]: U3.53(AN26/RD3) ; also sheet 1
S38_P [analog]: U3.54(AN25/RD2) ; also sheet 1
S_SCK: U3.50(SCK2/RD6) ; also sheet 1
S_SDI: U3.51(SDI2/RD5) ; also sheet 1
S_SDO: U3.52(SDO2/RD4) ; also sheet 1
S_SPI_EN: U3.49(!SS2!/RD7) ; also sheet 1
SCK4B: SPI-WEST.3 U4.50(SCK2/RD6)
SDI4B: SPI-WEST.4 U4.51(SDI2/RD5)
SDO4B: SPI-WEST.5 U4.52(SDO2/RD4)
SS4B: SPI-WEST.2 U4.49(!SS2!/RD7)
TX3: SER3.2 U3.31(RC6/TX1)
TX3B: U3.4(TX2/AN15/RG1)
TX4: SER4.2 U4.31(RC6/TX1)
TX4B: U4.4(TX2/AN15/RG1)
VCC [power]: C24.1 C25.1 C26.1 C27.1 C29.1 C30.1 C31.1 C32.1 C35.1 C36.1 C37.1 C38.1 C40.1 C41.1 C42.1 C43.1 C95.1 C96.1 L5.1 L6.1 R9.1 R10.1 SPI-WEST.6 U3.10(VDD) U3.26(VDD) U3.38(VDD) U3.57(VDD) U4.10(VDD) U4.26(VDD) U4.38(VDD) U4.57(VDD) ; also sheet 1,2,4,5
W_SCK: U3.34(RC3/SCK1) U4.34(RC3/SCK1) ; also sheet 4,5
W_SD_36: U3.36(RC5/SDO1) ; also sheet 4
W_SD_43: U3.35(RC4/SDI1) U4.36(RC5/SDO1)
W_SD_84: U4.35(RC4/SDI1) ; also sheet 5
Unconnected: U3.3(RG0) U3.6(AN13/RG3) U3.8(AN12/RG4) U3.29(RC1) U3.30(RC0) U3.59(RE7) U3.60(RE6) U3.61(RE5) U3.62(RE4) U3.63(RE3) U4.3(RG0) U4.6(AN13/RG3) U4.8(AN12/RG4) U4.30(RC0) U4.59(RE7) U4.60(RE6) U4.61(RE5) U4.62(RE4) U4.63(RE3)

### Notes on the sheet
- Sensor Frontend Test
- Generic SFE
- Block 3/4
- Copyright (C) 2016 Herbert Poetzl
  Licensed under CERN OHL v.1.2

## Sheet 4 of 6
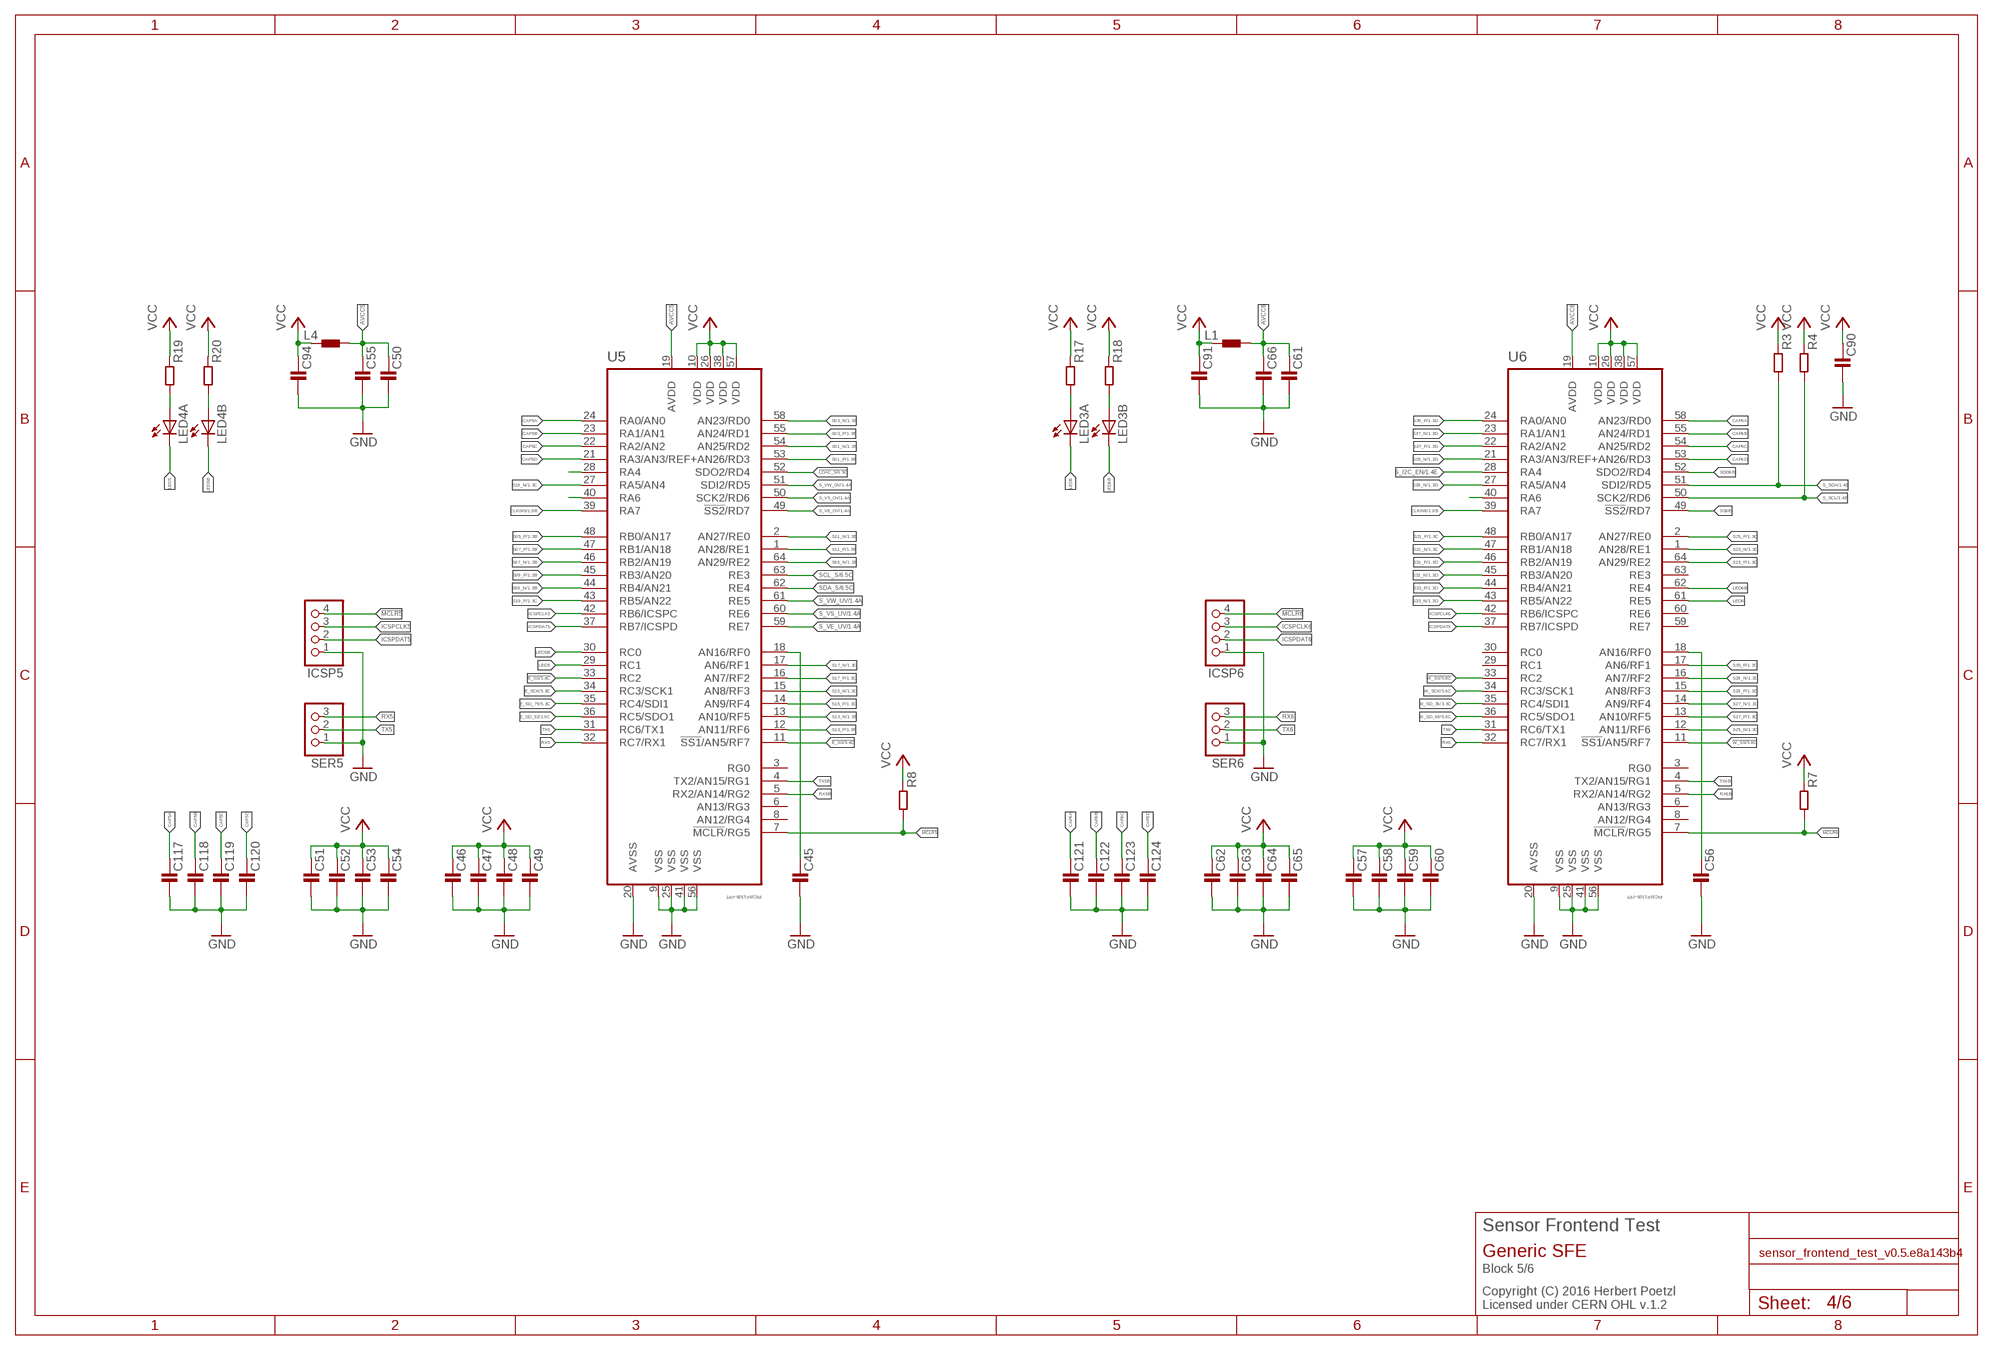
[diagram p3: schematic, sheet 4]

### Parts
C45  C0402-B  [0402-B]
C46  C0402-B  [0402-B]
C47  C0402-B  [0402-B]
C48  C0402-B  [0402-B]
C49  C0402-B  [0402-B]
C50  C0402-B  [0402-B]
C51  C0402-B  [0402-B]
C52  C0402-B  [0402-B]
C53  C0402-B  [0402-B]
C54  C0402-B  [0402-B]
C55  C0402-B  [0402-B]
C56  C0402-B  [0402-B]
C57  C0402-B  [0402-B]
C58  C0402-B  [0402-B]
C59  C0402-B  [0402-B]
C60  C0402-B  [0402-B]
C61  C0402-B  [0402-B]
C62  C0402-B  [0402-B]
C63  C0402-B  [0402-B]
C64  C0402-B  [0402-B]
C65  C0402-B  [0402-B]
C66  C0402-B  [0402-B]
C90  C0402-B  [0402-B]
C91  C0402-B  [0402-B]
C94  C0402-B  [0402-B]
C117  C0402-B  [0402-B]
C118  C0402-B  [0402-B]
C119  C0603-B  [0603-B]
C120  C0603-B  [0603-B]
C121  C0402-B  [0402-B]
C122  C0402-B  [0402-B]
C123  C0603-B  [0603-B]
C124  C0603-B  [0603-B]
ICSP5  PINHD-1X04_2.00  [1X04M]
ICSP6  PINHD-1X04_2.00  [1X04M]
L1  L0402-B  [0402-B]
L4  L0402-B  [0402-B]
LED3  DUAL-LED-0404  [0404]
LED4  DUAL-LED-0404  [0404]
R3  R0402-B  [0402-B]
R4  R0402-B  [0402-B]
R7  R0402-B  [0402-B]
R8  R0402-B  [0402-B]
R17  R0402-B  [0402-B]
R18  R0402-B  [0402-B]
R19  R0402-B  [0402-B]
R20  R0402-B  [0402-B]
SER5  PINHD-1X03_2.00  [1X03M]
SER6  PINHD-1X03_2.00  [1X03M]
U5  PIC16F1526-I/PT  [QFP50P1200X1200X120-64N]
U6  PIC16F1526-I/PT  [QFP50P1200X1200X120-64N]

### Nets
!E_SS: U5.11(!SS1!/AN5/RF7) U5.33(RC2) ; also sheet 2,5
!LDAC_S: U5.52(SDO2/RD4) ; also sheet 6
!MCLR5!: ICSP5.4 R8.2 U5.7(!MCLR!/RG5)
!MCLR6!: ICSP6.4 R7.2 U6.7(!MCLR!/RG5)
!W_SS: U6.11(!SS1!/AN5/RF7) U6.33(RC2) ; also sheet 3,5
AVCC5 [power]: C50.1 C55.1 L4.2 U5.19(AVDD)
AVCC6 [power]: C61.1 C66.1 L1.2 U6.19(AVDD)
CAP5A [analog]: C117.1 U5.24(RA0/AN0)
CAP5B [analog]: C118.1 U5.23(RA1/AN1)
CAP5C [analog]: C119.1 U5.22(RA2/AN2)
CAP5D [analog]: C120.1 U5.21(RA3/AN3/REF+)
CAP6A [analog]: C121.1 U6.58(AN23/RD0)
CAP6B [analog]: C122.1 U6.55(AN24/RD1)
CAP6C [analog]: C123.1 U6.54(AN25/RD2)
CAP6D [analog]: C124.1 U6.53(AN26/RD3)
CLKIN5: U5.39(RA7) ; also sheet 1
CLKIN6: U6.39(RA7) ; also sheet 1
E_SCK: U5.34(RC3/SCK1) ; also sheet 2,5
E_SD_52: U5.36(RC5/SDO1) ; also sheet 2
E_SD_75: U5.35(RC4/SDI1) ; also sheet 5
GND [power]: C45.2 C46.2 C47.2 C48.2 C49.2 C50.2 C51.2 C52.2 C53.2 C54.2 C55.2 C56.2 C57.2 C58.2 C59.2 C60.2 C61.2 C62.2 C63.2 C64.2 C65.2 C66.2 C90.2 C91.2 C94.2 C117.2 C118.2 C119.2 C120.2 C121.2 C122.2 C123.2 C124.2 ICSP5.1 ICSP6.1 SER5.1 SER6.1 U5.9(VSS) U5.20(AVSS) U5.25(VSS) U5.41(VSS) U5.56(VSS) U6.9(VSS) U6.20(AVSS) U6.25(VSS) U6.41(VSS) U6.56(VSS) ; also sheet 1,2,3,5,6
ICSPCLK5: ICSP5.3 U5.42(RB6/ICSPC)
ICSPCLK6: ICSP6.3 U6.42(RB6/ICSPC)
ICSPDAT5: ICSP5.2 U5.37(RB7/ICSPD)
ICSPDAT6: ICSP6.2 U6.37(RB7/ICSPD)
LED5: LED4.4(A:C) U5.29(RC1)
LED5B: LED4.3(B:C) U5.30(RC0)
LED6: LED3.4(A:C) U6.61(RE5)
LED6B: LED3.3(B:C) U6.62(RE4)
N$2: C45.1 U5.18(AN16/RF0)
N$22: LED3.1(A:A) R17.2
N$23: LED3.2(B:A) R18.2
N$24: LED4.1(A:A) R19.2
N$25: LED4.2(B:A) R20.2
N$28: U5.40(RA6)
N$29: U6.40(RA6)
N$44: U5.28(RA4)
N$49: C56.1 U6.18(AN16/RF0)
RX5: SER5.3 U5.32(RC7/RX1)
RX5B: U5.5(RX2/AN14/RG2)
RX6: SER6.3 U6.32(RC7/RX1)
RX6B: U6.5(RX2/AN14/RG2)
S01_N [analog]: U5.54(AN25/RD2) ; also sheet 1
S01_P [analog]: U5.53(AN26/RD3) ; also sheet 1
S03_N [analog]: U5.58(AN23/RD0) ; also sheet 1
S03_P [analog]: U5.55(AN24/RD1) ; also sheet 1
S05_N [analog]: U5.64(AN29/RE2) ; also sheet 1
S05_P [analog]: U5.48(RB0/AN17) ; also sheet 1
S07_N [analog]: U5.46(RB2/AN19) ; also sheet 1
S07_P [analog]: U5.47(RB1/AN18) ; also sheet 1
S09_N [analog]: U5.44(RB4/AN21) ; also sheet 1
S09_P [analog]: U5.45(RB3/AN20) ; also sheet 1
S11_N [analog]: U5.2(AN27/RE0) ; also sheet 1
S11_P [analog]: U5.1(AN28/RE1) ; also sheet 1
S13_N [analog]: U5.13(AN10/RF5) ; also sheet 1
S13_P [analog]: U5.12(AN11/RF6) ; also sheet 1
S15_N [analog]: U5.15(AN8/RF3) ; also sheet 1
S15_P [analog]: U5.14(AN9/RF4) ; also sheet 1
S17_N [analog]: U5.17(AN6/RF1) ; also sheet 1
S17_P [analog]: U5.16(AN7/RF2) ; also sheet 1
S19_N [analog]: U5.27(RA5/AN4) ; also sheet 1
S19_P [analog]: U5.43(RB5/AN22) ; also sheet 1
S21_N [analog]: U6.47(RB1/AN18) ; also sheet 1
S21_P [analog]: U6.48(RB0/AN17) ; also sheet 1
S23_N [analog]: U6.1(AN28/RE1) ; also sheet 1
S23_P [analog]: U6.64(AN29/RE2) ; also sheet 1
S25_N [analog]: U6.12(AN11/RF6) ; also sheet 1
S25_P [analog]: U6.2(AN27/RE0) ; also sheet 1
S27_N [analog]: U6.14(AN9/RF4) ; also sheet 1
S27_P [analog]: U6.13(AN10/RF5) ; also sheet 1
S29_N [analog]: U6.16(AN7/RF2) ; also sheet 1
S29_P [analog]: U6.15(AN8/RF3) ; also sheet 1
S31_N [analog]: U6.45(RB3/AN20) ; also sheet 1
S31_P [analog]: U6.46(RB2/AN19) ; also sheet 1
S33_N [analog]: U6.43(RB5/AN22) ; also sheet 1
S33_P [analog]: U6.44(RB4/AN21) ; also sheet 1
S35_N [analog]: U6.21(RA3/AN3/REF+) ; also sheet 1
S35_P [analog]: U6.17(AN6/RF1) ; also sheet 1
S37_N [analog]: U6.23(RA1/AN1) ; also sheet 1
S37_P [analog]: U6.22(RA2/AN2) ; also sheet 1
S39_N [analog]: U6.27(RA5/AN4) ; also sheet 1
S39_P [analog]: U6.24(RA0/AN0) ; also sheet 1
S_I2C_EN: U6.28(RA4) ; also sheet 1
S_SCL: R4.2 U6.50(SCK2/RD6) ; also sheet 1
S_SDA: R3.2 U6.51(SDI2/RD5) ; also sheet 1
S_VE_OV: U5.49(!SS2!/RD7) ; also sheet 1
S_VE_UV: U5.59(RE7) ; also sheet 1
S_VS_OV: U5.50(SCK2/RD6) ; also sheet 1
S_VS_UV: U5.60(RE6) ; also sheet 1
S_VW_OV: U5.51(SDI2/RD5) ; also sheet 1
S_VW_UV: U5.61(RE5) ; also sheet 1
SCL_S: U5.63(RE3) ; also sheet 6
SDA_S: U5.62(RE4) ; also sheet 6
SDO6B: U6.52(SDO2/RD4)
SS6B: U6.49(!SS2!/RD7)
TX5: SER5.2 U5.31(RC6/TX1)
TX5B: U5.4(TX2/AN15/RG1)
TX6: SER6.2 U6.31(RC6/TX1)
TX6B: U6.4(TX2/AN15/RG1)
VCC [power]: C46.1 C47.1 C48.1 C49.1 C51.1 C52.1 C53.1 C54.1 C57.1 C58.1 C59.1 C60.1 C62.1 C63.1 C64.1 C65.1 C90.1 C91.1 C94.1 L1.1 L4.1 R3.1 R4.1 R7.1 R8.1 R17.1 R18.1 R19.1 R20.1 U5.10(VDD) U5.26(VDD) U5.38(VDD) U5.57(VDD) U6.10(VDD) U6.26(VDD) U6.38(VDD) U6.57(VDD) ; also sheet 1,2,3,5
W_SCK: U6.34(RC3/SCK1) ; also sheet 3,5
W_SD_36: U6.35(RC4/SDI1) ; also sheet 3
W_SD_68: U6.36(RC5/SDO1) ; also sheet 5
Unconnected: U5.3(RG0) U5.6(AN13/RG3) U5.8(AN12/RG4) U6.3(RG0) U6.6(AN13/RG3) U6.8(AN12/RG4) U6.29(RC1) U6.30(RC0) U6.59(RE7) U6.60(RE6) U6.63(RE3)

### Notes on the sheet
- Sensor Frontend Test
- Generic SFE
- Block 5/6
- Copyright (C) 2016 Herbert Poetzl
  Licensed under CERN OHL v.1.2

## Sheet 5 of 6
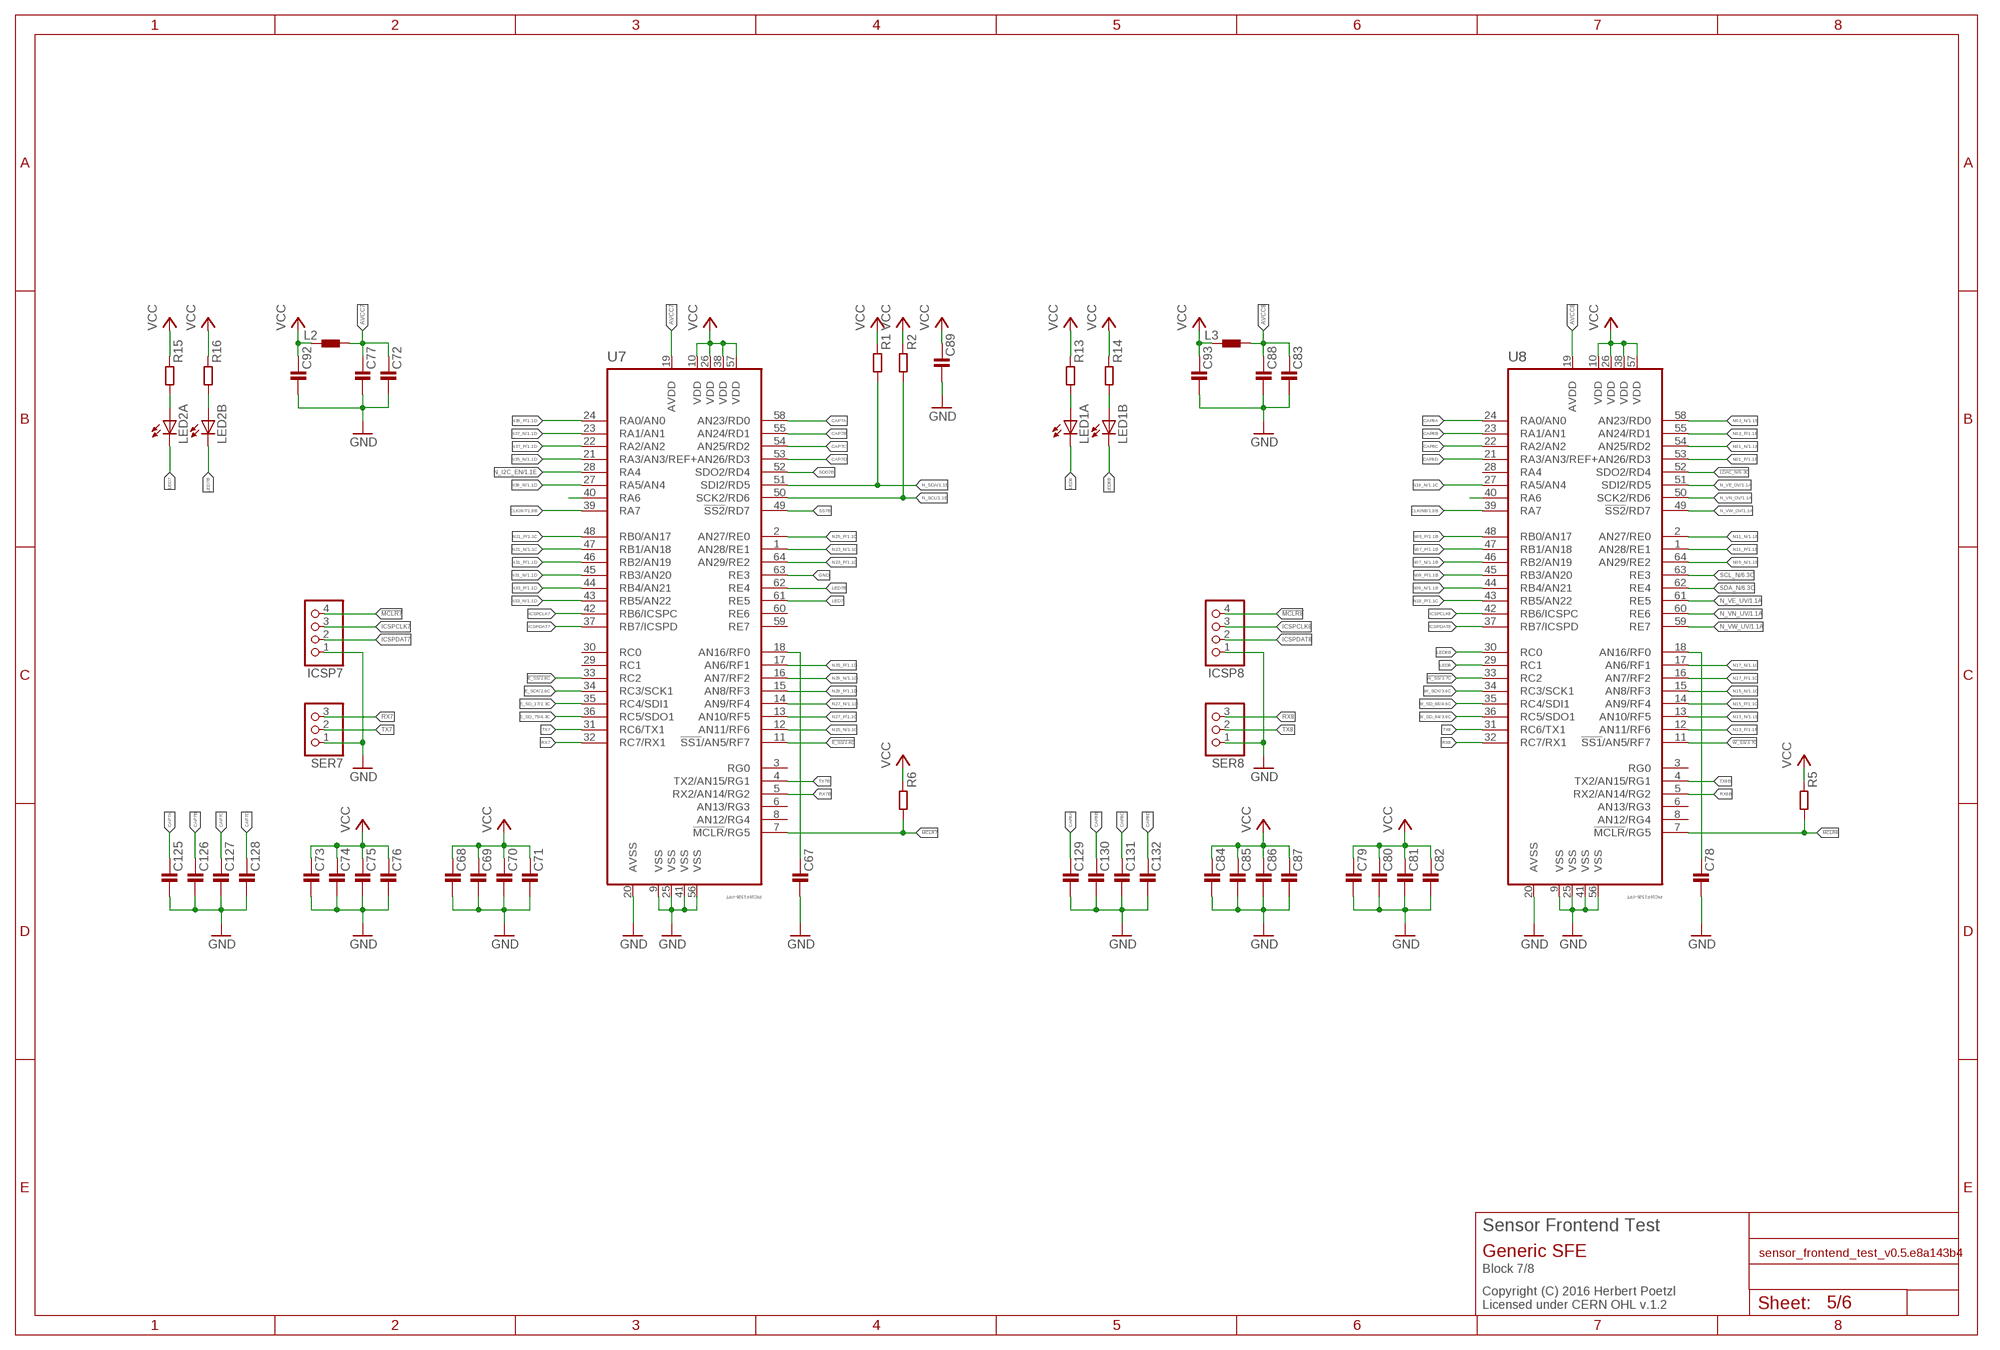
[diagram p4: schematic, sheet 5]

### Parts
C67  C0402-B  [0402-B]
C68  C0402-B  [0402-B]
C69  C0402-B  [0402-B]
C70  C0402-B  [0402-B]
C71  C0402-B  [0402-B]
C72  C0402-B  [0402-B]
C73  C0402-B  [0402-B]
C74  C0402-B  [0402-B]
C75  C0402-B  [0402-B]
C76  C0402-B  [0402-B]
C77  C0402-B  [0402-B]
C78  C0402-B  [0402-B]
C79  C0402-B  [0402-B]
C80  C0402-B  [0402-B]
C81  C0402-B  [0402-B]
C82  C0402-B  [0402-B]
C83  C0402-B  [0402-B]
C84  C0402-B  [0402-B]
C85  C0402-B  [0402-B]
C86  C0402-B  [0402-B]
C87  C0402-B  [0402-B]
C88  C0402-B  [0402-B]
C89  C0402-B  [0402-B]
C92  C0402-B  [0402-B]
C93  C0402-B  [0402-B]
C125  C0402-B  [0402-B]
C126  C0402-B  [0402-B]
C127  C0603-B  [0603-B]
C128  C0603-B  [0603-B]
C129  C0402-B  [0402-B]
C130  C0402-B  [0402-B]
C131  C0603-B  [0603-B]
C132  C0603-B  [0603-B]
ICSP7  PINHD-1X04_2.00  [1X04M]
ICSP8  PINHD-1X04_2.00  [1X04M]
L2  L0402-B  [0402-B]
L3  L0402-B  [0402-B]
LED1  DUAL-LED-0404  [0404]
LED2  DUAL-LED-0404  [0404]
R1  R0402-B  [0402-B]
R2  R0402-B  [0402-B]
R5  R0402-B  [0402-B]
R6  R0402-B  [0402-B]
R13  R0402-B  [0402-B]
R14  R0402-B  [0402-B]
R15  R0402-B  [0402-B]
R16  R0402-B  [0402-B]
SER7  PINHD-1X03_2.00  [1X03M]
SER8  PINHD-1X03_2.00  [1X03M]
U7  PIC16F1526-I/PT  [QFP50P1200X1200X120-64N]
U8  PIC16F1526-I/PT  [QFP50P1200X1200X120-64N]

### Nets
!E_SS: U7.11(!SS1!/AN5/RF7) U7.33(RC2) ; also sheet 2,4
!LDAC_N: U8.52(SDO2/RD4) ; also sheet 6
!MCLR7!: ICSP7.4 R6.2 U7.7(!MCLR!/RG5)
!MCLR8!: ICSP8.4 R5.2 U8.7(!MCLR!/RG5)
!W_SS: U8.11(!SS1!/AN5/RF7) U8.33(RC2) ; also sheet 3,4
AVCC7 [power]: C72.1 C77.1 L2.2 U7.19(AVDD)
AVCC8 [power]: C83.1 C88.1 L3.2 U8.19(AVDD)
CAP7A [analog]: C125.1 U7.58(AN23/RD0)
CAP7B [analog]: C126.1 U7.55(AN24/RD1)
CAP7C [analog]: C127.1 U7.54(AN25/RD2)
CAP7D [analog]: C128.1 U7.53(AN26/RD3)
CAP8A [analog]: C129.1 U8.24(RA0/AN0)
CAP8B [analog]: C130.1 U8.23(RA1/AN1)
CAP8C [analog]: C131.1 U8.22(RA2/AN2)
CAP8D [analog]: C132.1 U8.21(RA3/AN3/REF+)
CLKIN7: U7.39(RA7) ; also sheet 1
CLKIN8: U8.39(RA7) ; also sheet 1
E_SCK: U7.34(RC3/SCK1) ; also sheet 2,4
E_SD_17: U7.35(RC4/SDI1) ; also sheet 2
E_SD_75: U7.36(RC5/SDO1) ; also sheet 4
GND [power]: C67.2 C68.2 C69.2 C70.2 C71.2 C72.2 C73.2 C74.2 C75.2 C76.2 C77.2 C78.2 C79.2 C80.2 C81.2 C82.2 C83.2 C84.2 C85.2 C86.2 C87.2 C88.2 C89.2 C92.2 C93.2 C125.2 C126.2 C127.2 C128.2 C129.2 C130.2 C131.2 C132.2 ICSP7.1 ICSP8.1 SER7.1 SER8.1 U7.9(VSS) U7.20(AVSS) U7.25(VSS) U7.41(VSS) U7.56(VSS) U7.63(RE3) U8.9(VSS) U8.20(AVSS) U8.25(VSS) U8.41(VSS) U8.56(VSS) ; also sheet 1,2,3,4,6
ICSPCLK7: ICSP7.3 U7.42(RB6/ICSPC)
ICSPCLK8: ICSP8.3 U8.42(RB6/ICSPC)
ICSPDAT7: ICSP7.2 U7.37(RB7/ICSPD)
ICSPDAT8: ICSP8.2 U8.37(RB7/ICSPD)
LED7: LED2.4(A:C) U7.61(RE5)
LED7B: LED2.3(B:C) U7.62(RE4)
LED8: LED1.4(A:C) U8.29(RC1)
LED8B: LED1.3(B:C) U8.30(RC0)
N01_N [analog]: U8.54(AN25/RD2) ; also sheet 1
N01_P [analog]: U8.53(AN26/RD3) ; also sheet 1
N03_N [analog]: U8.58(AN23/RD0) ; also sheet 1
N03_P [analog]: U8.55(AN24/RD1) ; also sheet 1
N05_N [analog]: U8.64(AN29/RE2) ; also sheet 1
N05_P [analog]: U8.48(RB0/AN17) ; also sheet 1
N07_N [analog]: U8.46(RB2/AN19) ; also sheet 1
N07_P [analog]: U8.47(RB1/AN18) ; also sheet 1
N09_N [analog]: U8.44(RB4/AN21) ; also sheet 1
N09_P [analog]: U8.45(RB3/AN20) ; also sheet 1
N11_N [analog]: U8.2(AN27/RE0) ; also sheet 1
N11_P [analog]: U8.1(AN28/RE1) ; also sheet 1
N13_N [analog]: U8.13(AN10/RF5) ; also sheet 1
N13_P [analog]: U8.12(AN11/RF6) ; also sheet 1
N15_N [analog]: U8.15(AN8/RF3) ; also sheet 1
N15_P [analog]: U8.14(AN9/RF4) ; also sheet 1
N17_N [analog]: U8.17(AN6/RF1) ; also sheet 1
N17_P [analog]: U8.16(AN7/RF2) ; also sheet 1
N19_N [analog]: U8.27(RA5/AN4) ; also sheet 1
N19_P [analog]: U8.43(RB5/AN22) ; also sheet 1
N21_N [analog]: U7.47(RB1/AN18) ; also sheet 1
N21_P [analog]: U7.48(RB0/AN17) ; also sheet 1
N23_N [analog]: U7.1(AN28/RE1) ; also sheet 1
N23_P [analog]: U7.64(AN29/RE2) ; also sheet 1
N25_N [analog]: U7.12(AN11/RF6) ; also sheet 1
N25_P [analog]: U7.2(AN27/RE0) ; also sheet 1
N27_N [analog]: U7.14(AN9/RF4) ; also sheet 1
N27_P [analog]: U7.13(AN10/RF5) ; also sheet 1
N29_N [analog]: U7.16(AN7/RF2) ; also sheet 1
N29_P [analog]: U7.15(AN8/RF3) ; also sheet 1
N31_N [analog]: U7.45(RB3/AN20) ; also sheet 1
N31_P [analog]: U7.46(RB2/AN19) ; also sheet 1
N33_N [analog]: U7.43(RB5/AN22) ; also sheet 1
N33_P [analog]: U7.44(RB4/AN21) ; also sheet 1
N35_N [analog]: U7.21(RA3/AN3/REF+) ; also sheet 1
N35_P [analog]: U7.17(AN6/RF1) ; also sheet 1
N37_N [analog]: U7.23(RA1/AN1) ; also sheet 1
N37_P [analog]: U7.22(RA2/AN2) ; also sheet 1
N39_N [analog]: U7.27(RA5/AN4) ; also sheet 1
N39_P [analog]: U7.24(RA0/AN0) ; also sheet 1
N$16: LED1.1(A:A) R13.2
N$19: LED1.2(B:A) R14.2
N$20: LED2.1(A:A) R15.2
N$21: LED2.2(B:A) R16.2
N$30: U7.40(RA6)
N$31: U8.40(RA6)
N$169: C67.1 U7.18(AN16/RF0)
N$196: C78.1 U8.18(AN16/RF0)
N_I2C_EN: U7.28(RA4) ; also sheet 1
N_SCL: R2.2 U7.50(SCK2/RD6) ; also sheet 1
N_SDA: R1.2 U7.51(SDI2/RD5) ; also sheet 1
N_VE_OV: U8.51(SDI2/RD5) ; also sheet 1
N_VE_UV: U8.61(RE5) ; also sheet 1
N_VN_OV: U8.50(SCK2/RD6) ; also sheet 1
N_VN_UV: U8.60(RE6) ; also sheet 1
N_VW_OV: U8.49(!SS2!/RD7) ; also sheet 1
N_VW_UV: U8.59(RE7) ; also sheet 1
RX7: SER7.3 U7.32(RC7/RX1)
RX7B: U7.5(RX2/AN14/RG2)
RX8: SER8.3 U8.32(RC7/RX1)
RX8B: U8.5(RX2/AN14/RG2)
SCL_N: U8.63(RE3) ; also sheet 6
SDA_N: U8.62(RE4) ; also sheet 6
SDO7B: U7.52(SDO2/RD4)
SS7B: U7.49(!SS2!/RD7)
TX7: SER7.2 U7.31(RC6/TX1)
TX7B: U7.4(TX2/AN15/RG1)
TX8: SER8.2 U8.31(RC6/TX1)
TX8B: U8.4(TX2/AN15/RG1)
VCC [power]: C68.1 C69.1 C70.1 C71.1 C73.1 C74.1 C75.1 C76.1 C79.1 C80.1 C81.1 C82.1 C84.1 C85.1 C86.1 C87.1 C89.1 C92.1 C93.1 L2.1 L3.1 R1.1 R2.1 R5.1 R6.1 R13.1 R14.1 R15.1 R16.1 U7.10(VDD) U7.26(VDD) U7.38(VDD) U7.57(VDD) U8.10(VDD) U8.26(VDD) U8.38(VDD) U8.57(VDD) ; also sheet 1,2,3,4
W_SCK: U8.34(RC3/SCK1) ; also sheet 3,4
W_SD_68: U8.35(RC4/SDI1) ; also sheet 4
W_SD_84: U8.36(RC5/SDO1) ; also sheet 3
Unconnected: U7.3(RG0) U7.6(AN13/RG3) U7.8(AN12/RG4) U7.29(RC1) U7.30(RC0) U7.59(RE7) U7.60(RE6) U8.3(RG0) U8.6(AN13/RG3) U8.8(AN12/RG4) U8.28(RA4)

### Notes on the sheet
- Sensor Frontend Test
- Generic SFE
- Block 7/8
- Copyright (C) 2016 Herbert Poetzl
  Licensed under CERN OHL v.1.2

## Sheet 6 of 6
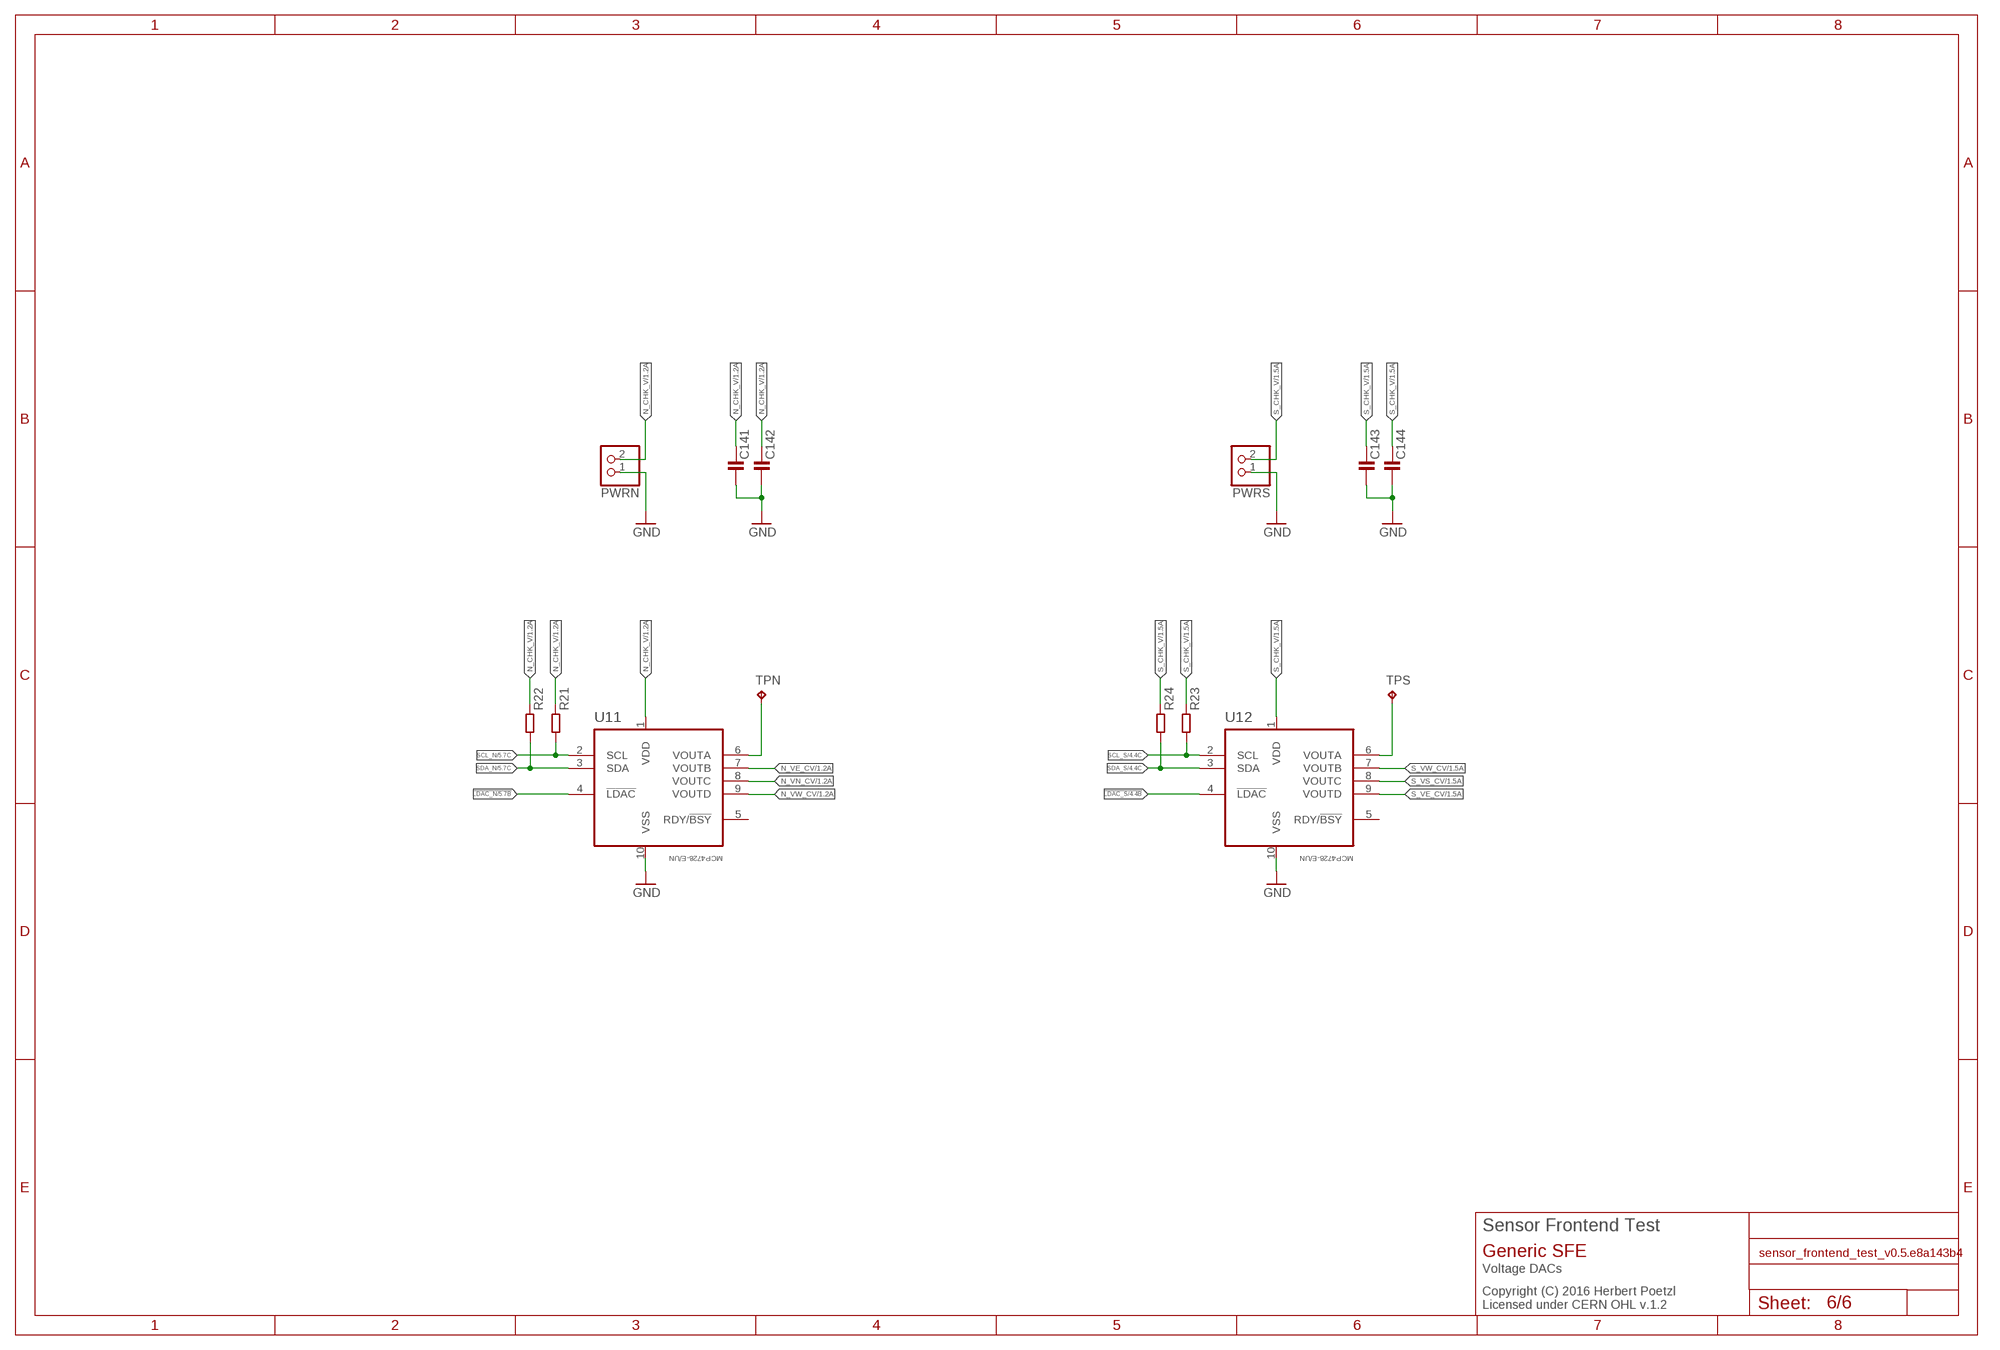
[diagram p5: schematic, sheet 6]

### Parts
C141  C0402-B  [0402-B]
C142  C0402-B  [0402-B]
C143  C0402-B  [0402-B]
C144  C0402-B  [0402-B]
PWRN  PINHD-1X02_2.00  [1X02M]
PWRS  PINHD-1X02_2.00  [1X02M]
R21  R0402-B  [0402-B]
R22  R0402-B  [0402-B]
R23  R0402-B  [0402-B]
R24  R0402-B  [0402-B]
TPN  TPTP16R  [TP16R]
TPS  TPTP16R  [TP16R]
U11  MCP4728-E/UN  [SOP50P490X110-10N]
U12  MCP4728-E/UN  [SOP50P490X110-10N]

### Nets
!LDAC_N: U11.4(!LDAC) ; also sheet 5
!LDAC_S: U12.4(!LDAC) ; also sheet 4
GND [power]: C141.2 C142.2 C143.2 C144.2 PWRN.1 PWRS.1 U11.10(VSS) U12.10(VSS) ; also sheet 1,2,3,4,5
N$13: TPS.TP U12.6(VOUTA)
N$33: TPN.TP U11.6(VOUTA)
N_CHK_V: C141.1 C142.1 PWRN.2 R21.1 R22.1 U11.1(VDD) ; also sheet 1
N_VE_CV: U11.7(VOUTB) ; also sheet 1
N_VN_CV: U11.8(VOUTC) ; also sheet 1
N_VW_CV: U11.9(VOUTD) ; also sheet 1
S_CHK_V: C143.1 C144.1 PWRS.2 R23.1 R24.1 U12.1(VDD) ; also sheet 1
S_VE_CV: U12.9(VOUTD) ; also sheet 1
S_VS_CV: U12.8(VOUTC) ; also sheet 1
S_VW_CV: U12.7(VOUTB) ; also sheet 1
SCL_N: R21.2 U11.2(SCL) ; also sheet 5
SCL_S: R23.2 U12.2(SCL) ; also sheet 4
SDA_N: R22.2 U11.3(SDA) ; also sheet 5
SDA_S: R24.2 U12.3(SDA) ; also sheet 4
Unconnected: U11.5(RDY/!BSY) U12.5(RDY/!BSY)

### Notes on the sheet
- Sensor Frontend Test
- Generic SFE
- Voltage DACs
- Copyright (C) 2016 Herbert Poetzl
  Licensed under CERN OHL v.1.2

## Library data of the parts
C1-C144 = generic-rcl:C
ICSP1-ICSP8 = pinhead-2:PINHD-1X04: PIN HEADER
L1-L8 = generic-rcl:L
LED1-LED4 = led:DUAL-LED
PWR-NORTH PWR-SOUTH SPI-EAST SPI-WEST = pinhead-2:PINHD-1X06: PIN HEADER
PWRN PWRS SUP-N SUP-S = pinhead-2:PINHD-1X02: PIN HEADER
R1-R24 = generic-rcl:R
SER1-SER8 = pinhead-2:PINHD-1X03: PIN HEADER
TPN TPS = testpad:TP: Test pad
U1-U8 = pic16f1526:PIC16F1526-I/PT: MCU 14KB FLASH 768B RAM,TQFP-64; MPN: PIC16F1526-I/PT; OC_FARNELL: 1909408; OC_NEWARK: 13T4720; PACKAGE: TQFP-64; SUPPLIER: Microchip
U9 = si53365:SI53365: PROGRAMMABLE 3-PLL CLOCK SYNTHESIZER / MULTIPLIER / DIVIDER
U10 = SparkFun-FreqCtrl:OSCILLATOR: Generic 5x3 and 7x5 oscillators
U11 U12 = mcp4728:MCP4728-E/UN: IC, DAC, 12BIT, QUAD; MPN: MCP4728-E/UN; OC_FARNELL: 1800217; OC_NEWARK: 08R1808; PACKAGE: MSOP-10; SUPPLIER: MICROCHIP
X-NORTH X-SOUTH = fx10:FX10-144

## Net classes
0 default: width 0.152 mm, drill 0.254 mm
1 power: width 0.203 mm, drill 0.254 mm
2 analog: width 0.152 mm, drill 0.254 mm, clearance 0.305 mm